# EAGLE board A20-OLINUXINO-MICRO_4GB_Rev_F1 (EAGLE 4.16), part 1 of 6
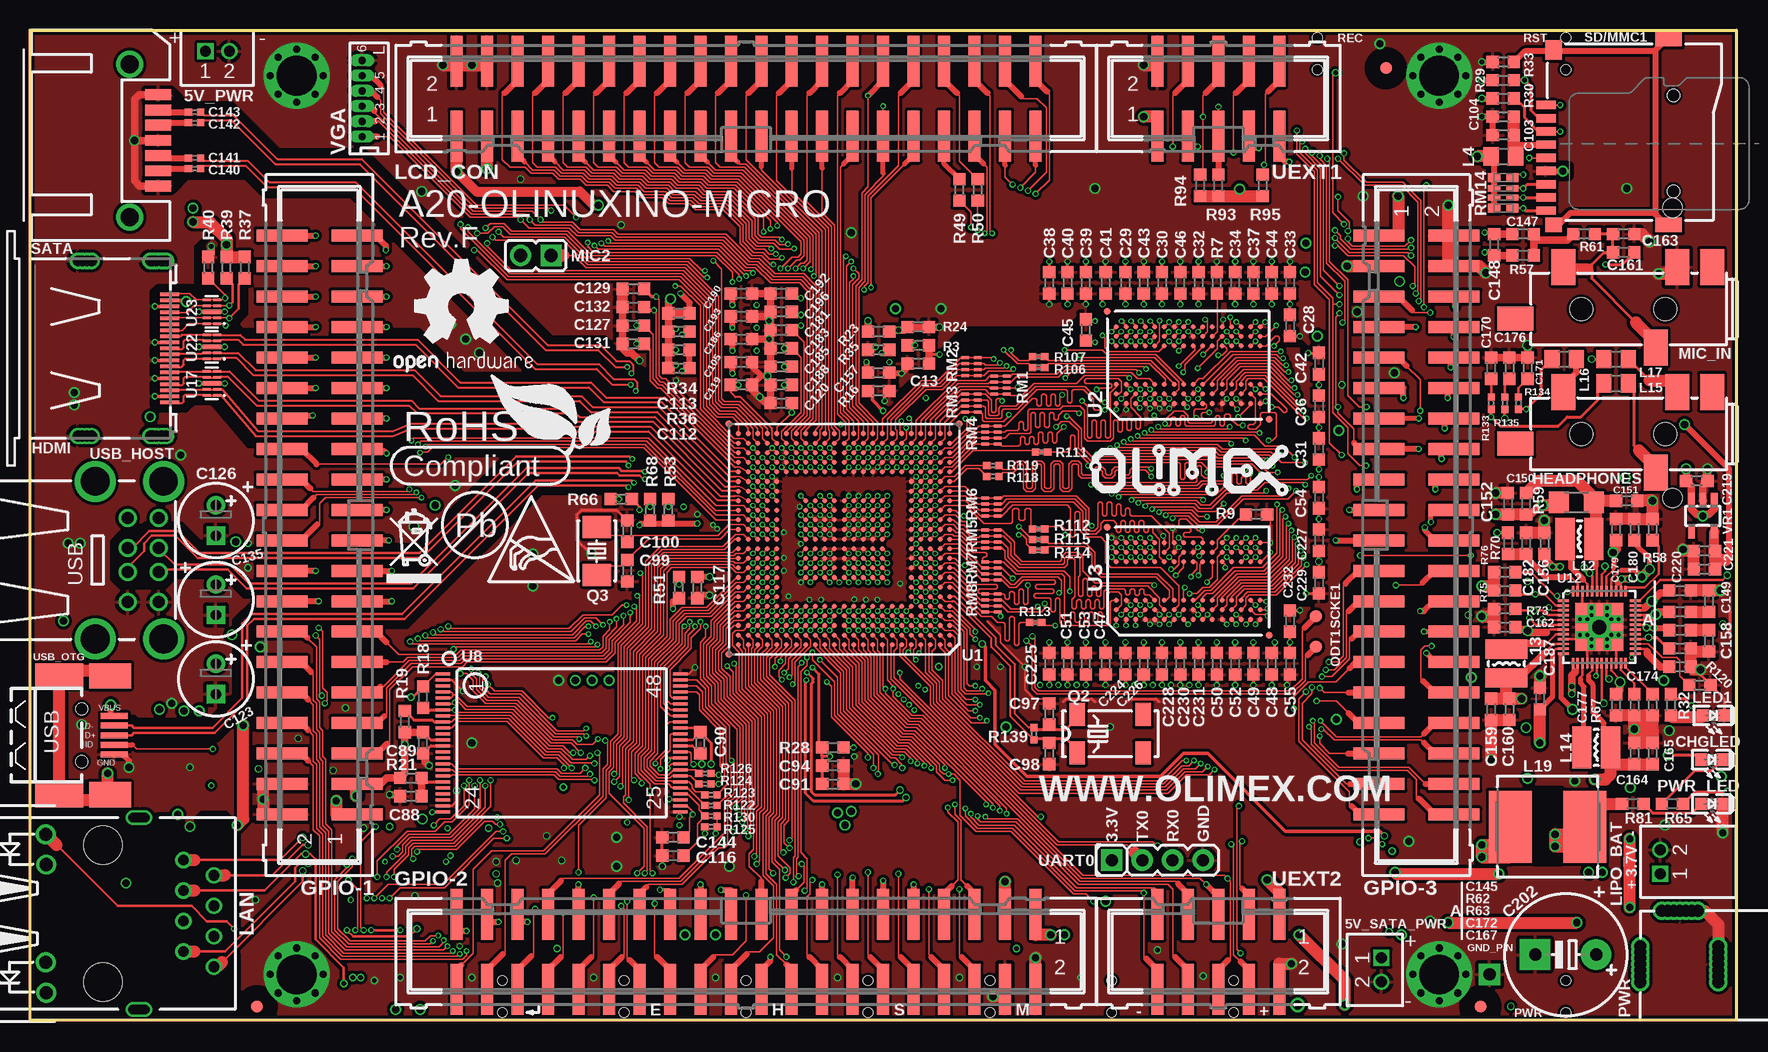
[diagram p5: board, top side]
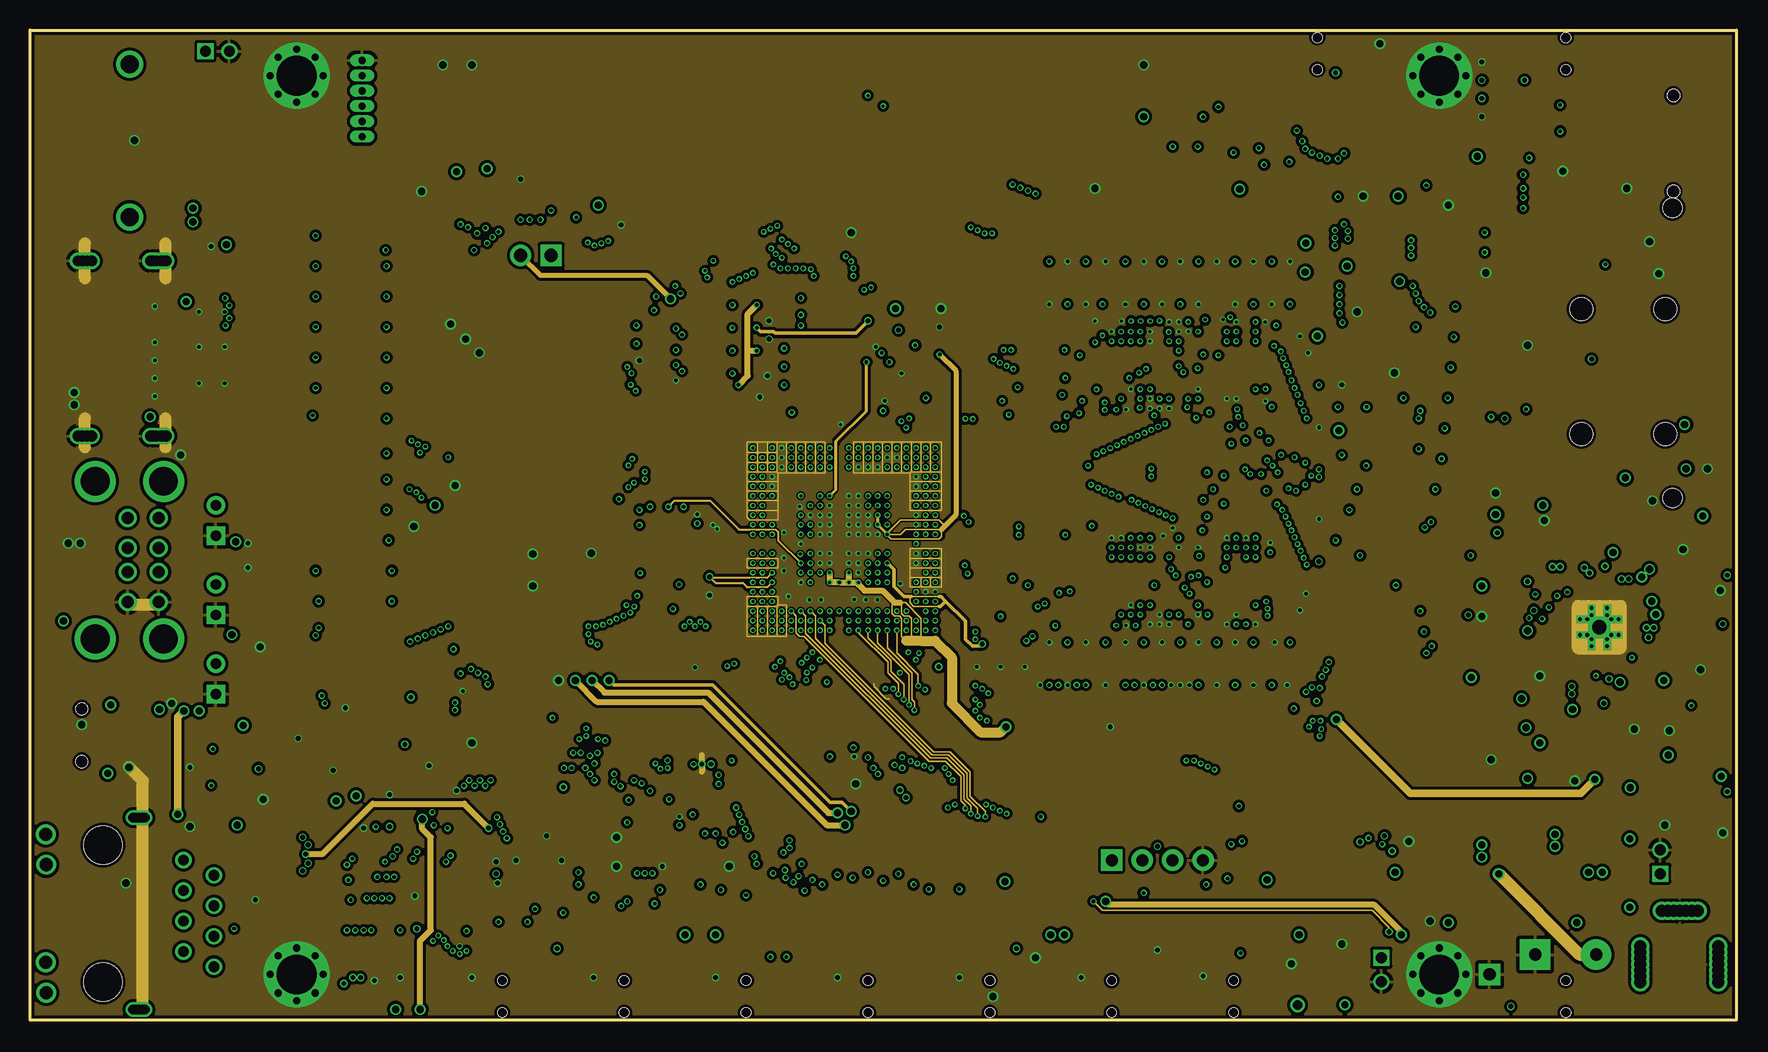
[diagram p6: board, inner layer Route2]
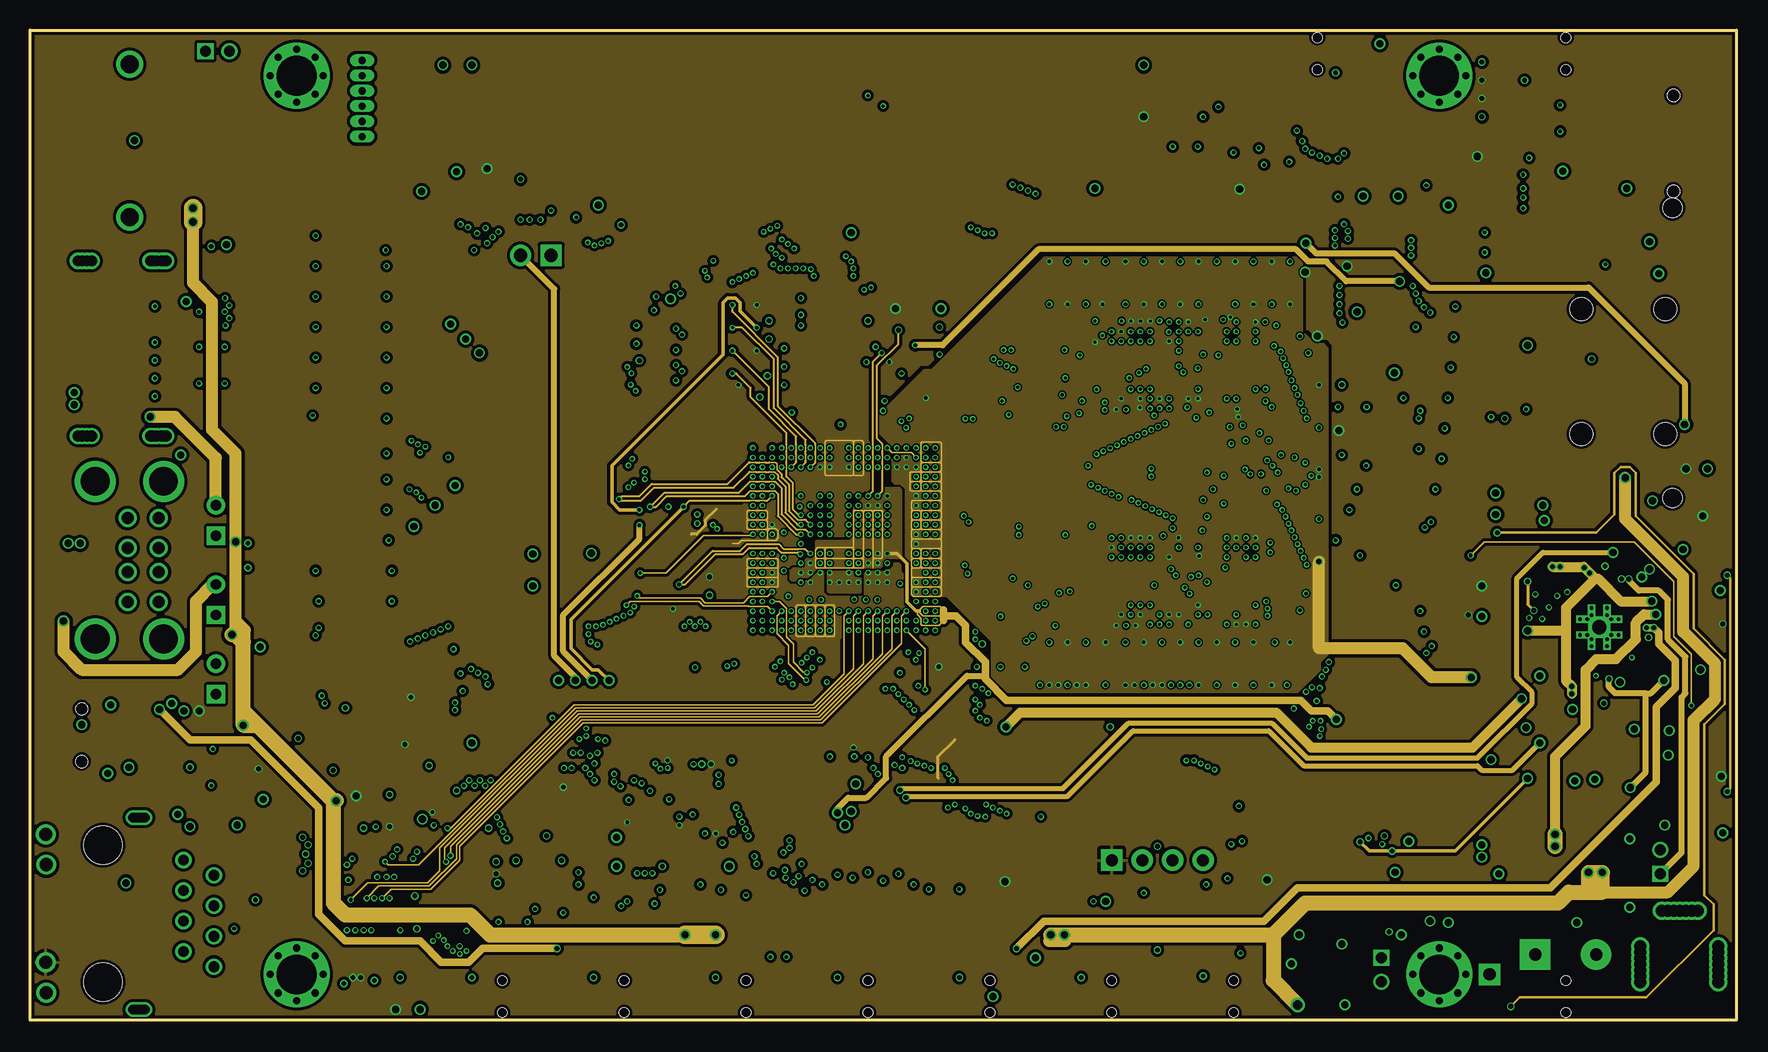
[diagram p7: board, inner layer Route15]
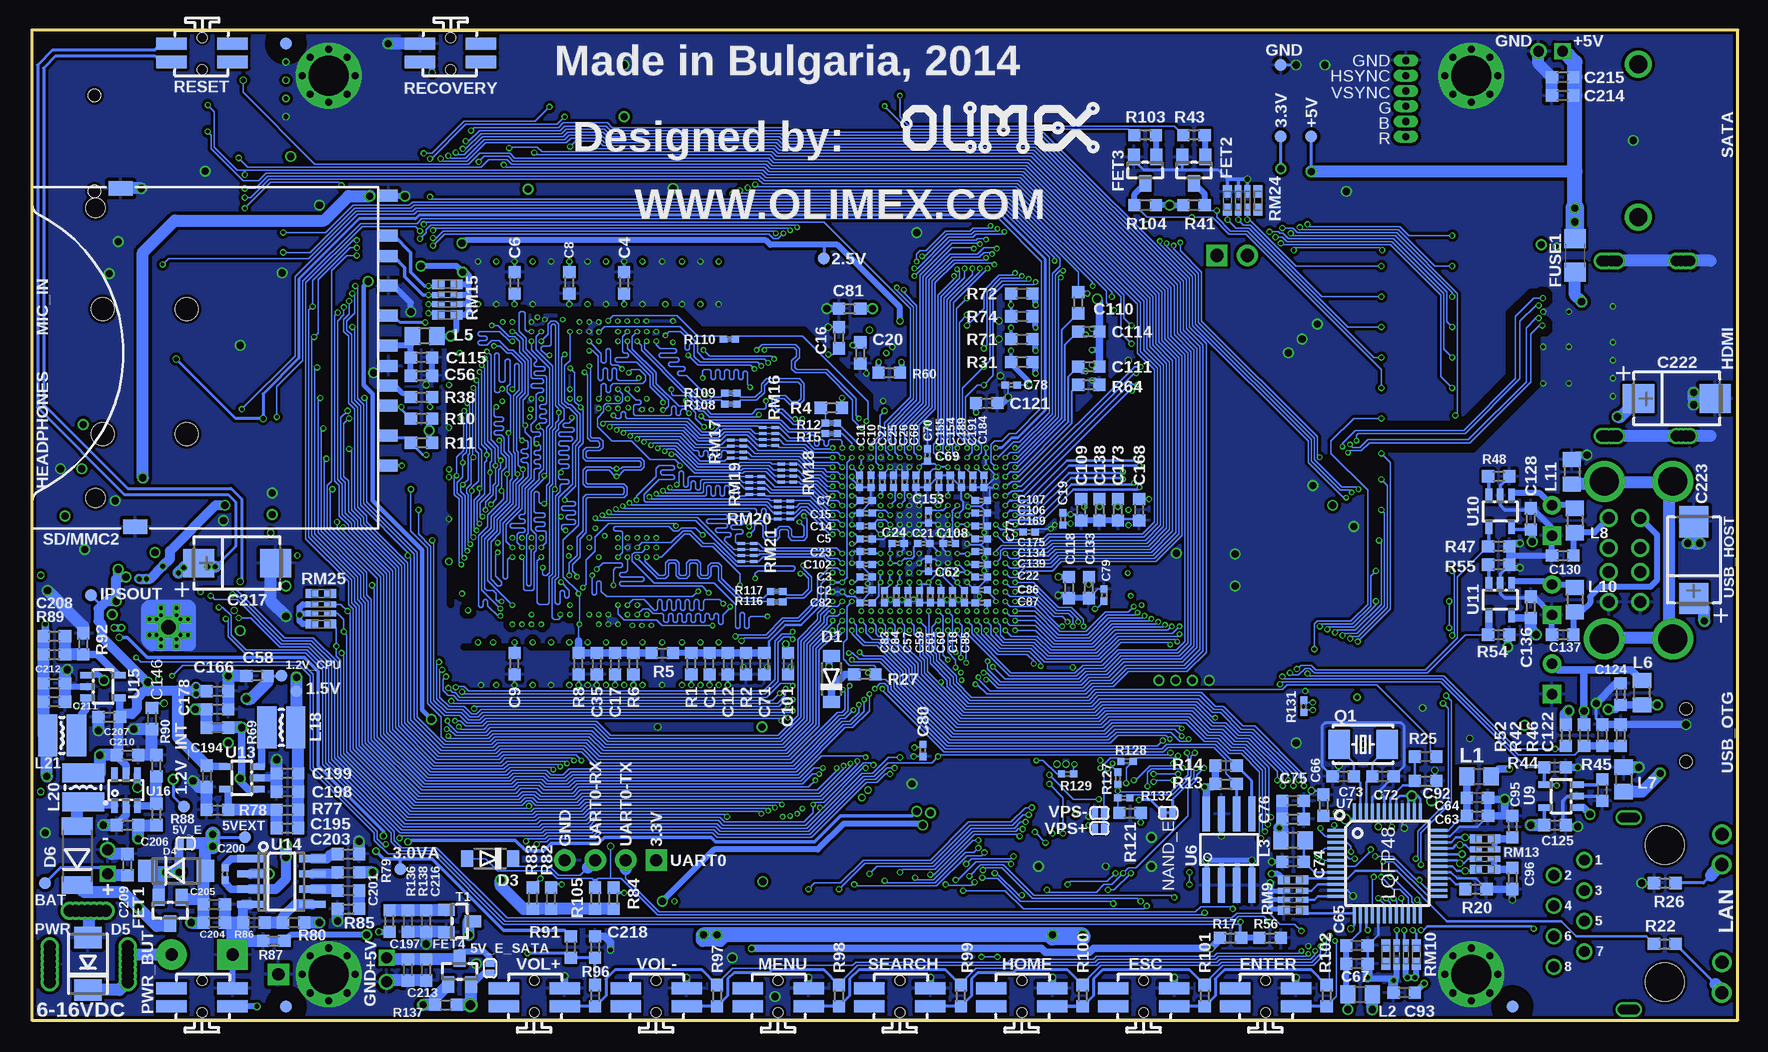
[diagram p8: board, bottom side, seen from below]

Size 142.24 x 82.55 mm. Coordinates in mm from the lower left corner, seen from the top.
Outline: 0,0 0,82.55 142.24,82.55 142.24,0 0,0
Copper layers (1*2*15*16): Top 0.018mm / dielectric 0.12mm / Route2 0.035mm / dielectric 1.2mm / Route15 0.035mm / dielectric 0.12mm / Bottom 0.018mm
Design rules "default": minimum track width 4.5mil, minimum drill 10mil, track to track 5mil, track to pad 5mil, pad to pad 5mil, via to via 5mil, smd to smd 1mil, copper to edge 10mil, drill to drill 8mil, minimum pad ring 6mil, minimum via ring 4mil, stop-mask expansion 4mil, vias tented up to drill 25mil, thermal gap 12mil
tRestrict: 315 lines
bRestrict: 272 lines

## Footprints (pad centres in the part's own frame; a part is rotated, then mirrored left to right if it is on the bottom)
TESTPAD_40-ROUND = smd 1.016 x 1.016: 1 0,0
SJ_1_SMALLER = smd 0.508 x 0.762: 1 -0.381,0; 2 0.381,0
DW02S = drill 0.9 square: 1 -1,0 | drill 0.9 round: 2 1,0
C0603_DWS = smd 1.016 x 1.016: 1 -0.889,0; 2 0.889,0
C0402_TI = smd 0.61 x 0.584: 1 -0.508,0; 2 0.508,0
E2,5-6,3 = drill 0.864 pad 1.524 round: + -1.27,0 | drill 0.864 pad 1.524 square: - 1.27,0
E5-10,5 = drill 1.016 pad 2.54 round: + -2.54,0 | drill 1.016 pad 2.54 square: - 2.54,0
CT7343 = smd 2.6 x 2.4: + 3.2,0; - -3.2,0
LED-0603 = smd 1.016 x 1.016: A 0.889,0; C -0.889,0
SOD-123 = smd 1 x 1.4: A 1.9,0; C -1.9,0
MLL-41 = smd 1.45 x 1.8: A 2.445,0; K -2.445,0
DO214AA = smd 1.778 x 2.286: A 2.177,0; C -2.177,0
MELF-MLL41 = smd 1.45 x 2.6: 1 -2.445,0; 2 2.445,0
SW_TAKT3X4 = smd 2.54 x 1.016: 1_1 -2.54,0.762; 1_2 2.54,0.762; 2_1 -2.54,-0.762; 2_2 2.54,-0.762 | hole 0.8: 0,-1.397; 0,1.27
SOT23 = smd 1.4 x 1: 1 1.1,-0.95; 2 1.1,0.95; 3 -1.1,0
1206 = smd 1.6 x 1.8: 1 -1.4,0; 2 1.4,0
TEST_PAD40/70/SQUARE = drill 1.016 pad 1.778 square: P$1 0,0
ML40-MALE(GBH-254-SMT-40) = smd 1 x 4.25: 1 -24.13,-3.125; 2 -24.13,3.125; 3 -21.59,-3.125; 4 -21.59,3.125; 5 -19.05,-3.125; 6 -19.05,3.125; 7 -16.51,-3.125; 8 -16.51,3.125; 9 -13.97,-3.125; 10 -13.97,3.125; 11 -11.43,-3.125; 12 -11.43,3.125; 13 -8.89,-3.125; 14 -8.89,3.125; 15 -6.35,-3.125; 16 -6.35,3.125; 17 -3.81,-3.125; 18 -3.81,3.125; 19 -1.27,-3.125; 20 -1.27,3.125; 21 1.27,-3.125; 22 1.27,3.125; 23 3.81,-3.125; 24 3.81,3.125; 25 6.35,-3.125; 26 6.35,3.125; 27 8.89,-3.125; 28 8.89,3.125; 29 11.43,-3.125; 30 11.43,3.125; 31 13.97,-3.125; 32 13.97,3.125; 33 16.51,-3.125; 34 16.51,3.125; 35 19.05,-3.125; 36 19.05,3.125; 37 21.59,-3.125; 38 21.59,3.125; 39 24.13,-3.125; 40 24.13,3.125
HDMI-SWM-19 = smd 0.28 x 1.6: 1 -4.5,-5.55; 2 -4,-5.55; 3 -3.5,-5.55; 4 -3,-5.55; 5 -2.5,-5.55; 6 -2,-5.55; 7 -1.5,-5.55; 8 -1,-5.55; 9 -0.5,-5.55; 10 0,-5.55; 11 0.5,-5.55; 12 1,-5.55; 13 1.5,-5.55; 14 2,-5.55; 15 2.5,-5.55; 16 3,-5.55; 17 3.5,-5.55; 18 4,-5.55; 19 4.5,-5.55 | drill 0.9 round: P$5 -7.3,-4.85; P$7 -7.3,1.35; P$9 7.3,1.35; P$11 7.3,-4.85; P$13 -7.3,-4.45; P$15 -7.3,1.75; P$18 7.3,1.75; P$20 7.3,-4.45; P$21 -7.3,-4.15; P$22 -7.3,-4.95; P$23 7.3,-4.95; P$24 7.3,-4.15; P$25 -7.3,-5.25; P$26 7.3,-5.25; P$27 7.3,0.95; P$28 -7.3,0.95; SH1 -7.3,-3.95; SH2 -7.3,2.1; SH3 7.3,2.1; SH4 7.3,-3.95
PJ-W47S-05D2-LF_5PIN_V2 = smd 2 x 3: 1 2.1,-0.5; 2 14.5,-0.5; 3 6.8,6.2; 5 5,-0.5 | smd 3 x 2: 4 18.5,3.8 | hole 1.9: 6,3; 13,3
L0805_5MIL_DWS = smd 1.27 x 1.524: 1 -1.016,0; 2 1.016,0
CD32 = smd 1.6 x 3.5: 1 -1.2,0; 2 1.2,0
8X8MM_3131 = smd 3.6 x 6: 1 -3.1,0; 2 3.1,0
RJLBC-060TC1_MILLING = drill 0.9 round: 1 -4.455,6.7; 2 -3.185,9.24; 3 -1.915,6.7; 4 -0.645,9.24; 5 0.625,6.7; 6 1.895,9.24; 7 3.165,6.7; 8 4.435,9.24 | drill 0.8 round: _1 -8,2.5; _2 -8,2.7; _3 -8,2.9; _4 -8,3.3; _5 -8,3.5; _6 8,3.5; _7 8,3.3; _8 8,2.9; _9 8,2.7; _10 8,2.5; GND1 -8,3.1; GND2 8,3.1 | drill 1.1 round: AG 4.07,-4.773; AY -6.61,-4.773; KG 6.61,-4.748; KY -4.07,-4.748 | hole 3.2: -5.715,0; 5.715,0
DW02R = drill 0.9 square: 1 -1,0 | drill 0.9 round: 2 1,0
JP1 = drill 1.1 pad 1.778 square: 1 0,-1.27 | drill 1.1 pad 1.778 round: 2 0,1.27
SJ_1_SMALLER_CLOSE_10MILS = smd 0.508 x 0.762: 1 -0.381,0; 2 0.381,0
PWR_JACK_UNI_MILLING = drill 1 round: + 0,4.75; +1 0,5.25; +2 0,5.75; +3 0,6.25; +4 0,4.25; +5 0,3.75; +6 0,3.25; - -6.5,4.75; -1 -6.5,5.25; -2 -6.5,5.75; -3 -6.5,4.25; -4 -6.5,3.75; -5 -6.5,6.25; -6 -6.5,3.25; -- -3.3,0.3; --1 -3.8,0.3; --2 -4.3,0.3; --3 -4.8,0.3; --4 -2.8,0.3; --5 -2.3,0.3; --6 -1.8,0.3
HCX-4S = smd 1.8 x 2.4: 1 -2,0; 2 2,0
MC-306 = smd 1.3 x 1.9: 1 -2.75,-1.6; 2 2.75,-1.6; 3 2.75,1.6; 4 -2.75,1.6
R0603_5MIL_DWS = smd 1.016 x 1.016: 1 -0.889,0; 2 0.889,0
R0402_TI_0R = smd 0.61 x 0.584: 1 -0.508,0; 2 0.508,0
0603_0R = smd 1.016 x 1.016: 1 -0.889,0; 2 0.889,0
R1206_5MIL_WS = smd 1.651 x 1.778: 1 -1.46,0; 2 1.46,0
R0402_TI = smd 0.61 x 0.584: 1 -0.508,0; 2 0.508,0
R_MATRIX_4_0402_25_625_0R = smd 0.25 x 0.625: 1.1 -0.75,-0.512; 1.2 -0.75,0.512; 2.1 -0.25,-0.512; 2.2 -0.25,0.512; 3.1 0.25,-0.512; 3.2 0.25,0.512; 4.1 0.75,-0.512; 4.2 0.75,0.512
R_MATRIX_4 = smd 0.762 x 1.016: 1.1 -1.27,-0.762; 1.2 -1.27,0.762; 4.1 1.27,-0.762; 4.2 1.27,0.762 | smd 0.508 x 1.016: 2.1 -0.381,-0.762; 2.2 -0.381,0.762; 3.1 0.381,-0.762; 3.2 0.381,0.762
SATA-PWA-07 = smd 0.9 x 2.2: 1 -4.25,-4.8; 2 -2.98,-4.8; 3 -1.71,-4.8; 4 -0.44,-4.8; 5 0.83,-4.8; 6 2.1,-4.8; 7 3.37,-4.8 | drill 1.5 round: P$8 -6.81,-2.44; P$9 5.93,-2.44
TFC-WPAPR-08 = smd 1.6 x 0.7: 1 -7.375,2.25; 2 -7.375,1.15; 3 -7.375,0.05; 4 -7.375,-1.05; 5 -7.375,-2.15; 6 -7.375,-3.25; 7 -7.375,-4.35; 8 -7.375,-5.45; 9 -7.375,-6.55 | smd 1.4 x 1.2: 10 -6.75,-7.75 | smd 1.4 x 1.6: 11 -6.75,6.85 | smd 2.2 x 1.2: 12 2.85,-7.75; 13 2.85,7.75 | hole 1: 3.25,-4.95; 3.25,3.05
SD_CARD = smd 1.5 x 1: 1 -15.3,6.48; 2 -15.3,3.98; 3 -15.3,0.68; 4 -15.3,-1.03; 5 -15.3,-3.53; 6 -15.3,-6.03; 7 -15.3,-8.46; 8 -15.3,-10.16; 9 -15.3,8.98; CD -15.3,2.33; WP -15.3,-13.51 | smd 2 x 1.2: SH1 7.05,-14.1; SH2 5.85,14.1 | hole 1.6: 9.15,-12.49; 9.15,11.7
TFBGA441 = smd 0.4 x 0.4: A1 -8.8,-8.8; A2 -8.8,-8; A3 -8.8,-7.2; A4 -8.8,-6.4; A5 -8.8,-5.6; A6 -8.8,-4.8; A7 -8.8,-4; A8 -8.8,-3.2; A9 -8.8,-2.4; A10 -8.8,-1.6; A11 -8.8,-0.8; A12 -8.8,0; A13 -8.8,0.8; A14 -8.8,1.6; A15 -8.8,2.4; A16 -8.8,3.2; A17 -8.8,4; A18 -8.8,4.8; A19 -8.8,5.6; A20 -8.8,6.4; A21 -8.8,7.2; A22 -8.8,8; A23 -8.8,8.8; AA1 7.2,-8.8; AA2 7.2,-8; AA3 7.2,-7.2; AA4 7.2,-6.4; AA5 7.2,-5.6; AA6 7.2,-4.8; AA7 7.2,-4; AA8 7.2,-3.2; AA9 7.2,-2.4; AA10 7.2,-1.6; AA11 7.2,-0.8; AA12 7.2,0; AA13 7.2,0.8; AA14 7.2,1.6; AA15 7.2,2.4; AA16 7.2,3.2; AA17 7.2,4; AA18 7.2,4.8; AA19 7.2,5.6; AA20 7.2,6.4; AA21 7.2,7.2; AA22 7.2,8; AA23 7.2,8.8; AB1 8,-8.8; AB2 8,-8; AB3 8,-7.2; AB4 8,-6.4; AB5 8,-5.6; AB6 8,-4.8; AB7 8,-4; AB8 8,-3.2; AB9 8,-2.4; AB10 8,-1.6; AB11 8,-0.8; AB12 8,0; AB13 8,0.8; AB14 8,1.6; AB15 8,2.4; AB16 8,3.2; AB17 8,4; AB18 8,4.8; AB19 8,5.6; AB20 8,6.4; AB21 8,7.2; AB22 8,8; AB23 8,8.8; AC1 8.8,-8.8; AC2 8.8,-8; AC3 8.8,-7.2; AC4 8.8,-6.4; AC5 8.8,-5.6; AC6 8.8,-4.8; AC7 8.8,-4; AC8 8.8,-3.2; AC9 8.8,-2.4; AC10 8.8,-1.6; AC11 8.8,-0.8; AC12 8.8,0; AC13 8.8,0.8; AC14 8.8,1.6; AC15 8.8,2.4; AC16 8.8,3.2; AC17 8.8,4; AC18 8.8,4.8; AC19 8.8,5.6; AC20 8.8,6.4; AC21 8.8,7.2; AC22 8.8,8; AC23 8.8,8.8; B1 -8,-8.8; B2 -8,-8; B3 -8,-7.2; B4 -8,-6.4; B5 -8,-5.6; B6 -8,-4.8; B7 -8,-4; B8 -8,-3.2; B9 -8,-2.4; B10 -8,-1.6; B11 -8,-0.8; B12 -8,0; B13 -8,0.8; B14 -8,1.6; B15 -8,2.4; B16 -8,3.2; B17 -8,4; B18 -8,4.8; B19 -8,5.6; B20 -8,6.4; B21 -8,7.2; B22 -8,8; B23 -8,8.8; C1 -7.2,-8.8; C2 -7.2,-8; C3 -7.2,-7.2; C4 -7.2,-6.4; C5 -7.2,-5.6; C6 -7.2,-4.8; C7 -7.2,-4; C8 -7.2,-3.2; C9 -7.2,-2.4; C10 -7.2,-1.6; C11 -7.2,-0.8; C12 -7.2,0; C13 -7.2,0.8; C14 -7.2,1.6; C15 -7.2,2.4; C16 -7.2,3.2; C17 -7.2,4; C18 -7.2,4.8; C19 -7.2,5.6; C20 -7.2,6.4; C21 -7.2,7.2; C22 -7.2,8; C23 -7.2,8.8; D1 -6.4,-8.8; D2 -6.4,-8; D3 -6.4,-7.2; D4 -6.4,-6.4; D5 -6.4,-5.6; D6 -6.4,-4.8; D7 -6.4,-4; D8 -6.4,-3.2; D9 -6.4,-2.4; D10 -6.4,-1.6; D11 -6.4,-0.8; D12 -6.4,0; D13 -6.4,0.8; D14 -6.4,1.6; D15 -6.4,2.4; D16 -6.4,3.2; D17 -6.4,4; D18 -6.4,4.8; D19 -6.4,5.6; D20 -6.4,6.4; D21 -6.4,7.2; D22 -6.4,8; D23 -6.4,8.8; E1 -5.6,-8.8; E2 -5.6,-8; E3 -5.6,-7.2; E4 -5.6,-6.4; E5 -5.6,-5.6; E6 -5.6,-4.8; E7 -5.6,-4; E8 -5.6,-3.2; E9 -5.6,-2.4; E10 -5.6,-1.6; E11 -5.6,-0.8; E12 -5.6,0; E13 -5.6,0.8; E14 -5.6,1.6; E15 -5.6,2.4; E16 -5.6,3.2; E17 -5.6,4; E18 -5.6,4.8; E19 -5.6,5.6; E20 -5.6,6.4; E21 -5.6,7.2; E22 -5.6,8; E23 -5.6,8.8; F1 -4.8,-8.8; F2 -4.8,-8; F3 -4.8,-7.2; F4 -4.8,-6.4; F5 -4.8,-5.6; F19 -4.8,5.6; F20 -4.8,6.4; F21 -4.8,7.2; F22 -4.8,8; F23 -4.8,8.8; G1 -4,-8.8; G2 -4,-8; G3 -4,-7.2; G4 -4,-6.4; G5 -4,-5.6; G19 -4,5.6; G20 -4,6.4; G21 -4,7.2; G22 -4,8; G23 -4,8.8; H1 -3.2,-8.8; H2 -3.2,-8; H3 -3.2,-7.2; H4 -3.2,-6.4; H5 -3.2,-5.6; H8 -3.2,-3.2; H9 -3.2,-2.4; H10 -3.2,-1.6; H11 -3.2,-0.8; H12 -3.2,0; H13 -3.2,0.8; H14 -3.2,1.6; H15 -3.2,2.4; H16 -3.2,3.2; H19 -3.2,5.6; H20 -3.2,6.4; H21 -3.2,7.2; H22 -3.2,8; H23 -3.2,8.8; J1 -2.4,-8.8; J2 -2.4,-8; J3 -2.4,-7.2; J4 -2.4,-6.4; J5 -2.4,-5.6; J8 -2.4,-3.2; J9 -2.4,-2.4; J10 -2.4,-1.6; J11 -2.4,-0.8; J12 -2.4,0; J13 -2.4,0.8; J14 -2.4,1.6; J15 -2.4,2.4; J16 -2.4,3.2; J19 -2.4,5.6; J20 -2.4,6.4; J21 -2.4,7.2; J22 -2.4,8; J23 -2.4,8.8; K1 -1.6,-8.8; K2 -1.6,-8; K3 -1.6,-7.2; K4 -1.6,-6.4; K5 -1.6,-5.6; K8 -1.6,-3.2; K9 -1.6,-2.4; K10 -1.6,-1.6; K11 -1.6,-0.8; K12 -1.6,0; K13 -1.6,0.8; K14 -1.6,1.6; K15 -1.6,2.4; K16 -1.6,3.2; K19 -1.6,5.6; K20 -1.6,6.4; K21 -1.6,7.2; K22 -1.6,8; K23 -1.6,8.8; L1 -0.8,-8.8; L2 -0.8,-8; L3 -0.8,-7.2; L4 -0.8,-6.4; L5 -0.8,-5.6; L8 -0.8,-3.2; L9 -0.8,-2.4; L10 -0.8,-1.6; L11 -0.8,-0.8; L12 -0.8,0; L13 -0.8,0.8; L14 -0.8,1.6; L15 -0.8,2.4; L16 -0.8,3.2; L19 -0.8,5.6; L20 -0.8,6.4; L21 -0.8,7.2; L22 -0.8,8; L23 -0.8,8.8; M1 0,-8.8; M2 0,-8; M3 0,-7.2; M4 0,-6.4; M5 0,-5.6; M8 0,-3.2; M9 0,-2.4; M10 0,-1.6; M11 0,-0.8; M12 0,0; M13 0,0.8; M14 0,1.6; M15 0,2.4; M16 0,3.2; M19 0,5.6; M20 0,6.4; M21 0,7.2; M22 0,8; M23 0,8.8; N1 0.8,-8.8; N2 0.8,-8; N3 0.8,-7.2; N4 0.8,-6.4; N5 0.8,-5.6; N8 0.8,-3.2; N9 0.8,-2.4; N10 0.8,-1.6; N11 0.8,-0.8; N12 0.8,0; N13 0.8,0.8; N14 0.8,1.6; N15 0.8,2.4; N16 0.8,3.2; N19 0.8,5.6; N20 0.8,6.4; N21 0.8,7.2; N22 0.8,8; N23 0.8,8.8; P1 1.6,-8.8; P2 1.6,-8; P3 1.6,-7.2; P4 1.6,-6.4; P5 1.6,-5.6; P8 1.6,-3.2; P9 1.6,-2.4; P10 1.6,-1.6; P11 1.6,-0.8; P12 1.6,0; P13 1.6,0.8; P14 1.6,1.6; P15 1.6,2.4; P16 1.6,3.2; P19 1.6,5.6; P20 1.6,6.4; P21 1.6,7.2; P22 1.6,8; P23 1.6,8.8; R1 2.4,-8.8; R2 2.4,-8; R3 2.4,-7.2; R4 2.4,-6.4; R5 2.4,-5.6; R8 2.4,-3.2; R9 2.4,-2.4; R10 2.4,-1.6; R11 2.4,-0.8; R12 2.4,0; R13 2.4,0.8; R14 2.4,1.6; R15 2.4,2.4; R16 2.4,3.2; R19 2.4,5.6; R20 2.4,6.4; R21 2.4,7.2; R22 2.4,8; R23 2.4,8.8; T1 3.2,-8.8; T2 3.2,-8; T3 3.2,-7.2; T4 3.2,-6.4; T5 3.2,-5.6; T8 3.2,-3.2; T9 3.2,-2.4; T10 3.2,-1.6; T11 3.2,-0.8; T12 3.2,0; T13 3.2,0.8; T14 3.2,1.6; T15 3.2,2.4; T16 3.2,3.2; T19 3.2,5.6; T20 3.2,6.4; T21 3.2,7.2; T22 3.2,8; T23 3.2,8.8; U1 4,-8.8; U2 4,-8; U3 4,-7.2; U4 4,-6.4; U5 4,-5.6; U19 4,5.6; U20 4,6.4; U21 4,7.2; U22 4,8; U23 4,8.8; V1 4.8,-8.8; V2 4.8,-8; V3 4.8,-7.2; V4 4.8,-6.4; V5 4.8,-5.6; V19 4.8,5.6; V20 4.8,6.4; V21 4.8,7.2; V22 4.8,8; V23 4.8,8.8; W1 5.6,-8.8; W2 5.6,-8; W3 5.6,-7.2; W4 5.6,-6.4; W5 5.6,-5.6; W6 5.6,-4.8; W7 5.6,-4; W8 5.6,-3.2; W9 5.6,-2.4; W10 5.6,-1.6; W11 5.6,-0.8; W12 5.6,0; W13 5.6,0.8; W14 5.6,1.6; W15 5.6,2.4; W16 5.6,3.2; W17 5.6,4; W18 5.6,4.8; W19 5.6,5.6; W20 5.6,6.4; W21 5.6,7.2; W22 5.6,8; W23 5.6,8.8; Y1 6.4,-8.8; Y2 6.4,-8; Y3 6.4,-7.2; Y4 6.4,-6.4; Y5 6.4,-5.6; Y6 6.4,-4.8; Y7 6.4,-4; Y8 6.4,-3.2; Y9 6.4,-2.4; Y10 6.4,-1.6; Y11 6.4,-0.8; Y12 6.4,0; Y13 6.4,0.8; Y14 6.4,1.6; Y15 6.4,2.4; Y16 6.4,3.2; Y17 6.4,4; Y18 6.4,4.8; Y19 6.4,5.6; Y20 6.4,6.4; Y21 6.4,7.2; Y22 6.4,8; Y23 6.4,8.8 | smd 0.6 x 0.6: FID1 -9.6,9.6; FID2 9.6,9.6; FID3 9.6,-9.6
FBGA96_MEM = smd 0.4 x 0.4: A1 -6,-3.2; A2 -6,-2.4; A3 -6,-1.6; A7 -6,1.6; A8 -6,2.4; A9 -6,3.2; B1 -5.2,-3.2; B2 -5.2,-2.4; B3 -5.2,-1.6; B7 -5.2,1.6; B8 -5.2,2.4; B9 -5.2,3.2; C1 -4.4,-3.2; C2 -4.4,-2.4; C3 -4.4,-1.6; C7 -4.4,1.6; C8 -4.4,2.4; C9 -4.4,3.2; D1 -3.6,-3.2; D2 -3.6,-2.4; D3 -3.6,-1.6; D7 -3.6,1.6; D8 -3.6,2.4; D9 -3.6,3.2; E1 -2.8,-3.2; E2 -2.8,-2.4; E3 -2.8,-1.6; E7 -2.8,1.6; E8 -2.8,2.4; E9 -2.8,3.2; F1 -2,-3.2; F2 -2,-2.4; F3 -2,-1.6; F7 -2,1.6; F8 -2,2.4; F9 -2,3.2; G1 -1.2,-3.2; G2 -1.2,-2.4; G3 -1.2,-1.6; G7 -1.2,1.6; G8 -1.2,2.4; G9 -1.2,3.2; H1 -0.4,-3.2; H2 -0.4,-2.4; H3 -0.4,-1.6; H7 -0.4,1.6; H8 -0.4,2.4; H9 -0.4,3.2; J1 0.4,-3.2; J2 0.4,-2.4; J3 0.4,-1.6; J7 0.4,1.6; J8 0.4,2.4; J9 0.4,3.2; K1 1.2,-3.2; K2 1.2,-2.4; K3 1.2,-1.6; K7 1.2,1.6; K8 1.2,2.4; K9 1.2,3.2; L1 2,-3.2; L2 2,-2.4; L3 2,-1.6; L7 2,1.6; L8 2,2.4; L9 2,3.2; M1 2.8,-3.2; M2 2.8,-2.4; M3 2.8,-1.6; M7 2.8,1.6; M8 2.8,2.4; M9 2.8,3.2; N1 3.6,-3.2; N2 3.6,-2.4; N3 3.6,-1.6; N7 3.6,1.6; N8 3.6,2.4; N9 3.6,3.2; P1 4.4,-3.2; P2 4.4,-2.4; P3 4.4,-1.6; P7 4.4,1.6; P8 4.4,2.4; P9 4.4,3.2; R1 5.2,-3.2; R2 5.2,-2.4; R3 5.2,-1.6; R7 5.2,1.6; R8 5.2,2.4; R9 5.2,3.2; T1 6,-3.2; T2 6,-2.4; T3 6,-1.6; T7 6,1.6; T8 6,2.4; T9 6,3.2 | smd 0.6 x 0.6: FID1 6.75,-4.5; FID2 -6.75,4.5
FIDUCIAL-1X3 = smd 1 x 1: 1 0,0
SO-08MN = smd 0.61 x 2.921: 1 -1.905,-2.981; 2 -0.635,-2.981; 3 0.635,-2.981; 4 1.905,-2.981; 5 1.905,2.981; 6 0.635,2.981; 7 -0.635,2.981; 8 -1.905,2.981
LQFP48 = smd 0.254 x 1.4: 1 -2.75,-4.3; 2 -2.25,-4.3; 3 -1.75,-4.3; 4 -1.25,-4.3; 5 -0.75,-4.3; 6 -0.25,-4.3; 7 0.25,-4.3; 8 0.75,-4.3; 9 1.25,-4.3; 10 1.75,-4.3; 11 2.25,-4.3; 12 2.75,-4.3; 25 2.75,4.3; 26 2.25,4.3; 27 1.75,4.3; 28 1.25,4.3; 29 0.75,4.3; 30 0.25,4.3; 31 -0.25,4.3; 32 -0.75,4.3; 33 -1.25,4.3; 34 -1.75,4.3; 35 -2.25,4.3; 36 -2.75,4.3 | smd 1.4 x 0.254: 13 4.3,-2.75; 14 4.3,-2.25; 15 4.3,-1.75; 16 4.3,-1.25; 17 4.3,-0.75; 18 4.3,-0.25; 19 4.3,0.25; 20 4.3,0.75; 21 4.3,1.25; 22 4.3,1.75; 23 4.3,2.25; 24 4.3,2.75; 37 -4.3,2.75; 38 -4.3,2.25; 39 -4.3,1.75; 40 -4.3,1.25; 41 -4.3,0.75; 42 -4.3,0.25; 43 -4.3,-0.25; 44 -4.3,-0.75; 45 -4.3,-1.25; 46 -4.3,-1.75; 47 -4.3,-2.25; 48 -4.3,-2.75
TSOP48 = smd 1.2 x 0.25: 1 -9.9,5.75; 2 -9.9,5.25; 3 -9.9,4.75; 4 -9.9,4.25; 5 -9.9,3.75; 6 -9.9,3.25; 7 -9.9,2.75; 8 -9.9,2.25; 9 -9.9,1.75; 10 -9.9,1.25; 11 -9.9,0.75; 12 -9.9,0.25; 13 -9.9,-0.25; 14 -9.9,-0.75; 15 -9.9,-1.25; 16 -9.9,-1.75; 17 -9.9,-2.25; 18 -9.9,-2.75; 19 -9.9,-3.25; 20 -9.9,-3.75; 21 -9.9,-4.25; 22 -9.9,-4.75; 23 -9.9,-5.25; 24 -9.9,-5.75; 25 9.9,-5.75; 26 9.9,-5.25; 27 9.9,-4.75; 28 9.9,-4.25; 29 9.9,-3.75; 30 9.9,-3.25; 31 9.9,-2.75; 32 9.9,-2.25; 33 9.9,-1.75; 34 9.9,-1.25; 35 9.9,-0.75; 36 9.9,-0.25; 37 9.9,0.25; 38 9.9,0.75; 39 9.9,1.25; 40 9.9,1.75; 41 9.9,2.25; 42 9.9,2.75; 43 9.9,3.25; 44 9.9,3.75; 45 9.9,4.25; 46 9.9,4.75; 47 9.9,5.25; 48 9.9,5.75
SOT23-5 = smd 1.2 x 0.55: 1 1.3,-0.95; 2 1.3,0; 3 1.3,0.95; 4 -1.3,0.95; 5 -1.3,-0.95
QFN48 = smd 0.2 x 0.9: 1 -2.2,-3; 2 -1.8,-3; 3 -1.4,-3; 4 -1,-3; 5 -0.6,-3; 6 -0.2,-3; 7 0.2,-3; 8 0.6,-3; 9 1,-3; 10 1.4,-3; 11 1.8,-3; 12 2.2,-3; 25 2.2,3; 26 1.8,3; 27 1.4,3; 28 1,3; 29 0.6,3; 30 0.2,3; 31 -0.2,3; 32 -0.6,3; 33 -1,3; 34 -1.4,3; 35 -1.8,3; 36 -2.2,3 | smd 0.9 x 0.2: 13 3,-2.2; 14 3,-1.8; 15 3,-1.4; 16 3,-1; 17 3,-0.6; 18 3,-0.2; 19 3,0.2; 20 3,0.6; 21 3,1; 22 3,1.4; 23 3,1.8; 24 3,2.2; 37 -3,2.2; 38 -3,1.8; 39 -3,1.4; 40 -3,1; 41 -3,0.6; 42 -3,0.2; 43 -3,-0.2; 44 -3,-0.6; 45 -3,-1; 46 -3,-1.4; 47 -3,-1.8; 48 -3,-2.2 | drill 1.2 pad 1.422 square: N1 0,0 | drill 0.3 pad 0.4 square: N2 -1.6,0.65; N3 -1,0.65; N4 -1.6,-0.65; N5 -1,-0.65; N6 -0.65,-1.6; N7 -0.65,-1; N8 0.65,-1.6; N9 0.65,-1; N10 1.6,-0.65; N11 1,-0.65; N12 1.6,0.65; N13 1,0.65; N14 0.65,1.6; N15 0.65,1; N16 -0.65,1.6; N17 -0.65,1 | smd 4 x 4: VSS 0,0
SOIC8 = smd 0.6 x 2.2: 1 -1.905,-2.6; 2 -0.635,-2.6; 3 0.635,-2.6; 4 1.905,-2.6; 5 1.905,2.6; 6 0.635,2.6; 7 -0.635,2.6; 8 -1.905,2.6
SOT23-6 = smd 0.55 x 1.2: 1 -0.95,-1.3; 2 0,-1.3; 3 0.95,-1.3; 4 0.95,1.3; 5 0,1.3; 6 -0.95,1.3
SLP2510P8 = smd 0.2 x 0.675: 1 -1,-0.438; 2 -0.5,-0.438; 4 0.5,-0.438; 5 1,-0.438; 6 1,0.438; 7 0.5,0.438; 9 -0.5,0.438; 10 -1,0.438 | smd 0.4 x 0.775: 3 0,-0.388; 8 0,0.388
HN1X4 = drill 1 pad 1.778 square: 1 -3.81,0 | drill 1 pad 1.778 round: 2 -1.27,0; 3 1.27,0; 4 3.81,0
ML10_S = smd 1 x 4.25: 1 -5.08,-3.125; 2 -5.08,3.125; 3 -2.54,-3.125; 4 -2.54,3.125; 5 0,-3.125; 6 0,3.125; 7 2.54,-3.125; 8 2.54,3.125; 9 5.08,-3.125; 10 5.08,3.125
USB_TWO_LEVEL = drill 1 round: 1.1 -3.5,2.62; 1.2 -1,2.62; 1.3 1,2.62; 1.4 3.5,2.62; 2.1 -3.5,0; 2.2 -1,0; 2.3 1,0; 2.4 3.5,0 | drill 2.4 round: GND1 -6.57,-2.7; GND2 6.57,-2.7; GND3 6.57,3; GND4 -6.57,3
USB_MINI_9PIN = smd 2.25 x 0.5: D+ 2.706,0; D- 2.706,0.8; GND 2.706,-1.6; ID 2.706,-0.8; VBUS 2.706,1.6 | smd 4 x 2.1: GND1 -1.9,4.95; GND3 -1.9,-4.95 | smd 3.5 x 2.1: GND2 2.35,4.95; GND4 2.35,-4.95 | hole 1: 0,2.2; 0,-2.2
CON1.27MM-6-SMALL_ICSP = drill 0.6 pad 1.016 long: 1 -3.175,0; 2 -1.905,0; 3 -0.635,0; 4 0.635,0; 5 1.905,0; 6 3.175,0
SOT-23-5 = smd 0.55 x 1.2: 1 -0.95,-1.3; 2 0,-1.3; 3 0.95,-1.3; 4 0.95,1.3; 5 -0.95,1.3

## Placement (x,y rotation side)
1.2V_CPU  TESTPADTESTPAD_40-ROUND  [TESTPAD_40-ROUND]  121.41,28.7 0 bottom
1.2V_INT  TESTPADTESTPAD_40-ROUND  [TESTPAD_40-ROUND]  129.54,17.78 0 bottom
1.5V  TESTPADTESTPAD_40-ROUND  [TESTPAD_40-ROUND]  120.14,27.43 0 bottom
2.5V  TESTPADTESTPAD_40-ROUND  [TESTPAD_40-ROUND]  76.2,63.5 0 bottom
3.0VA  TESTPADTESTPAD_40-ROUND  [TESTPAD_40-ROUND]  111.51,12.57 0 bottom
3.3V  TESTPADTESTPAD_40-ROUND  [TESTPAD_40-ROUND]  38.1,73.66 0 bottom
5V_E  Open  [SJ_1_SMALLER]  129.41,14.73 180 bottom
5V_E_SATA  [SJ_1_SMALLER]  104.01,4.32 90 bottom
5V_PWR  NA(DW02S)  [DW02S]  15.62,80.77 0 top
5V_SATA_PWR  DW02S  [DW02S]  112.65,4.19 270 top
5VEXT  TESTPADTESTPAD_40-ROUND  [TESTPAD_40-ROUND]  124.46,15.24 0 bottom
+5V  TESTPADTESTPAD_40-ROUND  [TESTPAD_40-ROUND]  35.56,73.66 0 bottom
BAT  TESTPADTESTPAD_40-ROUND  [TESTPAD_40-ROUND]  141.1,11.43 0 bottom
C1  220nF  [C0603_DWS]  85.72,29.72 90 bottom
C2  220nF  [C0402_TI]  72.67,35.86 180 bottom
C3  220nF  [C0402_TI]  72.67,36.93 180 bottom
C4  220nF  [C0603_DWS]  92.84,61.47 270 bottom
C5  220nF  [C0402_TI]  72.67,40.13 180 bottom
C6  220nF  [C0603_DWS]  101.98,61.47 270 bottom
C7  220nF  [C0402_TI]  72.67,43.33 180 bottom
C8  220nF  [C0603_DWS]  97.41,61.47 90 bottom
C9  220nF  [C0603_DWS]  101.98,29.72 90 bottom
C10  220nF  [C0402_TI]  72.26,44.91 90 bottom
C11  220nF  [C0402_TI]  73.2,44.91 90 bottom
C12  220nF  [C0603_DWS]  84.2,29.72 90 bottom
C13  22uF/6.3V  [C0603_DWS]  74.04,54.74 0 top
C14  220nF  [C0402_TI]  72.67,41.2 0 bottom
C15  220nF  [C0402_TI]  72.67,42.27 0 bottom
C16  220nF  [C0603_DWS]  74.93,56.9 270 bottom
C17  220nF  [C0603_DWS]  93.6,29.72 90 bottom
C18  220nF  [C0402_TI]  65.46,35.31 90 bottom
C19  220nF  [C0402_TI]  56.26,41.78 270 bottom
C20  220nF  [C0603_DWS]  73.15,55.63 90 bottom
C21  220nF  [C0402_TI]  67.87,39.75 180 bottom
C22  220nF  [C0402_TI]  63.07,36.93 180 bottom
C23  220nF  [C0402_TI]  72.67,39.07 0 bottom
C24  220nF  [C0402_TI]  70,39.75 180 bottom
C25  220nF  [C0402_TI]  70.38,44.91 270 bottom
C26  220nF  [C0402_TI]  69.44,44.91 270 bottom
C27  220nF  [C0402_TI]  71.32,44.91 270 bottom
C28  220nF  [C0603_DWS]  105.03,57.91 90 top
C29  220nF  [C0603_DWS]  91.31,61.47 90 top
C30  220nF  [C0603_DWS]  94.36,61.47 90 top
C31  220nF  [C0603_DWS]  107.44,47.62 270 top
C32  220nF  [C0603_DWS]  97.41,61.47 90 top
C33  220nF  [C0603_DWS]  105.03,61.47 270 top
C34  220nF  [C0603_DWS]  100.46,61.47 90 top
C35  220nF  [C0603_DWS]  95.12,29.72 90 bottom
C36  220nF  [C0603_DWS]  107.44,51.18 90 top
C37  220nF  [C0603_DWS]  101.98,61.47 270 top
C38  220nF  [C0603_DWS]  84.96,61.47 90 top
C39  220nF  [C0603_DWS]  88.01,61.47 90 top
C40  220nF  [C0603_DWS]  86.49,61.47 270 top
C41  220nF  [C0603_DWS]  89.66,61.47 270 top
C42  220nF  [C0603_DWS]  107.44,54.74 270 top
C43  220nF  [C0603_DWS]  92.84,61.47 270 top
C44  220nF  [C0603_DWS]  103.5,61.47 90 top
C45  220nF  [C0603_DWS]  88.01,57.53 270 top
C46  220nF  [C0603_DWS]  95.88,61.47 270 top
C47  220nF  [C0603_DWS]  89.66,29.72 90 top
C48  220nF  [C0603_DWS]  103.5,29.72 270 top
C49  220nF  [C0603_DWS]  101.98,29.72 90 top
C50  220nF  [C0603_DWS]  98.93,29.72 90 top
C51  220nF  [C0603_DWS]  86.49,29.72 90 top
C52  220nF  [C0603_DWS]  100.46,29.72 270 top
C53  220nF  [C0603_DWS]  88.01,29.72 270 top
C54  220nF  [C0603_DWS]  107.44,43.56 90 top
C55  220nF  [C0603_DWS]  105.03,29.72 90 top
C56  22uF/6.3V  [C0603_DWS]  109.73,53.72 180 bottom
C57  220nF  [C0402_TI]  69.19,35.31 90 bottom
C58  220nF  [C0603_DWS]  123.44,28.7 0 bottom
C59  220nF  [C0402_TI]  68.22,35.31 90 bottom
C60  220nF  [C0402_TI]  66.42,35.31 90 bottom
C61  220nF  [C0402_TI]  67.32,35.31 90 bottom
C62  220nF  [C0402_TI]  67.49,37.92 270 bottom
C63  100nF  [C0603_DWS]  21.72,17.02 180 bottom
C64  22uF/6.3V  [C0603_DWS]  21.72,18.54 180 bottom
C65  100nF  [C0603_DWS]  31.75,6.22 180 bottom
C66  100nF  [C0603_DWS]  34.54,17.91 270 bottom
C67  22uF/6.3V  [C0603_DWS]  31.75,4.7 180 bottom
C68  220nF  [C0402_TI]  68.5,44.91 90 bottom
C69  220nF  [C0402_TI]  67.56,47.12 270 bottom
C70  220nF  [C0402_TI]  67.56,44.91 90 bottom
C71  NA  [C0603_DWS]  81.15,29.72 90 bottom
C72  33pF  [C0603_DWS]  29.59,20.32 180 bottom
C73  33pF  [C0603_DWS]  32.89,20.32 0 bottom
C74  100nF  [C0603_DWS]  37.08,13.21 180 bottom
C75  100nF  [C0603_DWS]  37.08,18.29 0 bottom
C76  22uF/6.3V  [C0603_DWS]  37.08,16.76 0 bottom
C77  220nF  [C0402_TI]  59.08,40.69 180 bottom
C78  220nF  [C0402_TI]  60.58,52.96 0 bottom
C79  220nF  [C0402_TI]  52.83,35.43 270 bottom
C80  220nF  [C0402_TI]  67.94,22.48 90 bottom
C81  220nF  [C0603_DWS]  74.04,59.31 0 bottom
C82  220nF  [C0402_TI]  72.67,34.8 0 bottom
C83  220nF  [C0402_TI]  71.12,35.31 90 bottom
C84  220nF  [C0402_TI]  70.15,35.31 90 bottom
C85  220nF  [C0402_TI]  64.49,35.31 90 bottom
C86  220nF  [C0402_TI]  63.07,35.86 0 bottom
C87  220nF  [C0402_TI]  63.07,34.8 0 bottom
C88  100nF  [C0603_DWS]  31.75,18.67 0 top
C89  100nF  [C0603_DWS]  32.77,23.11 90 top
C90  100nF  [C0603_DWS]  55.88,23.11 90 top
C91  1uF  [C0603_DWS]  66.93,19.68 180 top
C92  100nF  [C0603_DWS]  26.04,19.94 180 bottom
C93  100nF  [C0603_DWS]  27.81,2.29 0 bottom
C94  100nF  [C0603_DWS]  66.93,21.21 180 top
C95  100nF  [C0603_DWS]  18.8,16.13 270 bottom
C96  100nF  [C0603_DWS]  18.8,11.81 90 bottom
C97  10pF  [C0603_DWS]  84.96,25.53 270 top
C98  10pF  [C0603_DWS]  84.96,22.22 90 top
C99  33pF  [C0603_DWS]  49.78,37.47 90 top
C100  33pF  [C0603_DWS]  49.78,40.77 270 top
C101  22uF/6.3V  [C0603_DWS]  79.18,29.72 90 bottom
C102  100nF  [C0402_TI]  72.67,38 0 bottom
C103  22uF/6.3V  [C0603_DWS]  122.81,73.79 0 top
C104  22uF/6.3V  [C0603_DWS]  122.81,75.31 0 top
C105  22uF/6.3V  [C0603_DWS]  59.31,54.86 180 top
C106  220nF  [C0402_TI]  63.07,42.27 180 bottom
C107  NC  [C0402_TI]  63.07,43.33 180 bottom
C108  NC  [C0402_TI]  65.74,39.75 0 bottom
C109  22uF/6.3V  [C0603_DWS]  54.74,42.55 90 bottom
C110  1uF  [C0603_DWS]  54.99,59.82 270 bottom
C111  220nF  [C0603_DWS]  54.1,54.48 180 bottom
C112  10uF/6.3V  [C0603_DWS]  54.1,54.36 0 top
C113  10uF/6.3V  [C0603_DWS]  54.1,57.4 0 top
C114  220nF  [C0603_DWS]  54.1,57.4 180 bottom
C115  22uF/6.3V  [C0603_DWS]  109.73,55.25 180 bottom
C116  NA(2.2uF)  [C0603_DWS]  53.59,13.72 180 top
C117  220nF  [C0603_DWS]  55.63,36.07 90 top
C118  220nF  [C0603_DWS]  55.75,36.07 90 bottom
C119  220nF  [C0603_DWS]  59.31,52.96 180 top
C120  220nF  [C0603_DWS]  62.61,51.44 0 top
C121  10uF/6.3V  [C0603_DWS]  62.61,51.44 180 bottom
C122  100nF  [C0603_DWS]  9.78,23.75 90 bottom
C123  100uF/16V/LOWESR/105C/6.3x11mm_RM2.5  [E2,5-6,3]  15.49,28.45 270 top
C124  100nF  [C0603_DWS]  9.78,27.18 90 bottom
C125  100nF  [C0603_DWS]  15.24,16.26 0 bottom
C126  100uF/16V/LOWESR/105C/6.3x11mm_RM2.5  [E2,5-6,3]  15.49,41.66 270 top
C127  1nF  [C0603_DWS]  50.29,57.91 0 top
C128  10uF/6.3V  [C0603_DWS]  17.27,41.78 90 bottom
C129  1nF  [C0603_DWS]  50.29,60.96 0 top
C130  100nF  [C0603_DWS]  14.61,38.73 180 bottom
C131  1nF  [C0603_DWS]  50.29,56.39 0 top
C132  1nF  [C0603_DWS]  50.29,59.44 0 top
C133  22uF/6.3V  [C0603_DWS]  54.1,36.07 90 bottom
C134  220nF  [C0402_TI]  63.07,39.07 180 bottom
C135  100uF/16V/LOWESR/105C/6.3x11mm_RM2.5  [E2,5-6,3]  15.49,35.05 270 top
C136  10uF/6.3V  [C0603_DWS]  17.27,34.42 90 bottom
C137  100nF  [C0603_DWS]  14.61,32.13 180 bottom
C138  22uF/6.3V  [C0603_DWS]  53.21,42.55 90 bottom
C139  220nF  [C0402_TI]  63.07,38 180 bottom
C140  10nF  [C0402_TI]  13.72,70.99 180 top
C141  10nF  [C0402_TI]  13.72,71.88 180 top
C142  10nF  [C0402_TI]  13.72,74.8 180 top
C143  10nF  [C0402_TI]  13.72,75.69 180 top
C144  NA(2.2uF)  [C0603_DWS]  53.59,15.24 180 top
C145  10uF/6.3V  [C0603_DWS]  137.54,35.81 180 top
C146  1uF  [C0603_DWS]  132.21,25.15 90 bottom
C147  10uF/6.3V  [C0603_DWS]  124.46,65.53 0 top
C148  10uF/6.3V  [C0603_DWS]  122.05,64.64 270 top
C149  10uF/6.3V  [C0603_DWS]  139.95,34.93 270 top
C150  1uF  [C0603_DWS]  124.71,43.05 270 top
C151  10uF/6.3V  [C0603_DWS]  133.1,43.31 0 top
C152  10uF/6.3V  [C0603_DWS]  123.19,43.05 90 top
C153  NA  [C0402_TI]  67.49,41.96 270 bottom
C154  NA  [C0402_TI]  65.66,44.91 90 bottom
C155  220nF  [C0402_TI]  66.6,44.91 90 bottom
C156  10uF/6.3V  [C0603_DWS]  126.24,39.75 90 top
C157  22uF/6.3V  [C0603_DWS]  70.74,53.98 180 top
C158  10uF/6.3V  [C0603_DWS]  139.95,31.62 90 top
C159  10uF/6.3V  [C0603_DWS]  121.79,25.91 270 top
C160  1nF  [C0603_DWS]  123.32,25.91 270 top
C161  100nF  [C0603_DWS]  132.84,64.01 0 top
C162  10uF/6.3V  [C0603_DWS]  122.94,32.77 180 top
C163  3.3nF  [C0603_DWS]  132.84,65.53 180 top
C164  10uF/6.3V  [C0603_DWS]  133.73,22.22 90 top
C165  1nF  [C0603_DWS]  135.25,22.22 90 top
C166  10uF/6.3V  [C0603_DWS]  126.75,27.43 0 bottom
C167  1uF  [C0603_DWS]  137.54,29.46 180 top
C168  22uF/6.3V  [C0603_DWS]  49.91,42.55 90 bottom
C169  220nF  [C0402_TI]  63.07,41.2 180 bottom
C170  100nF  [C0603_DWS]  121.79,54.36 270 top
C171  100nF  [C0603_DWS]  124.84,54.36 270 top
C172  10uF/6.3V  [C0603_DWS]  137.54,30.99 0 top
C173  22uF/6.3V  [C0603_DWS]  51.69,42.55 90 bottom
C174  1uF  [C0603_DWS]  135.25,26.29 90 top
C175  220nF  [C0402_TI]  63.07,40.13 180 bottom
C176  100nF  [C0603_DWS]  123.32,54.36 270 top
C177  10uF/6.3V  [C0603_DWS]  132.21,26.29 90 top
C178  10uF/6.3V  [C0603_DWS]  126.75,25.91 0 bottom
C179  10uF/6.3V  [C0603_DWS]  132.21,40.89 90 top
C180  10uF/6.3V  [C0603_DWS]  133.73,40.89 90 top
C181  NA  [C0603_DWS]  62.61,57.53 0 top
C182  1nF  [C0603_DWS]  124.71,39.75 270 top
C183  NA  [C0603_DWS]  62.61,56.01 0 top
C184  220nF  [C0402_TI]  62.84,44.91 270 bottom
C185  NA  [C0603_DWS]  62.61,54.48 0 top
C186  22uF/6.3V  [C0603_DWS]  59.31,56.77 180 top
C187  10uF/6.3V  [C0603_DWS]  125.86,26.8 90 top
C188  NA  [C0603_DWS]  62.61,52.96 0 top
C189  220nF  [C0402_TI]  64.72,44.91 270 bottom
C190  22uF/6.3V  [C0603_DWS]  59.31,60.58 180 top
C191  220nF  [C0402_TI]  63.78,44.91 270 bottom
C192  470nF  [C0603_DWS]  62.61,60.58 0 top
C193  22uF/6.3V  [C0603_DWS]  59.31,58.67 180 top
C194  22uF/6.3V  [C0603_DWS]  127.64,20.32 270 bottom
C195  22pF  [C0603_DWS]  120.9,16 180 bottom
C196  470nF  [C0603_DWS]  62.61,59.06 0 top
C197  22uF/6.3V  [C0603_DWS]  110.87,4.19 90 bottom
C198  22uF/6.3V  [C0603_DWS]  120.9,19.05 180 bottom
C199  22uF/6.3V  [C0603_DWS]  120.9,20.57 180 bottom
C200  10nF  [C0402_TI]  126.11,12.19 270 bottom
C201  3.3nF  [C0603_DWS]  115.82,10.79 0 bottom
C202  470uF/25V/LOWESR/105C  [E5-10,5]  128.02,5.46 180 top
C203  100nF  [C0603_DWS]  115.82,13.84 0 bottom
C204  22uF/6.3V  [C0603_DWS]  127,8.13 0 bottom
C205  22uF/6.3V  [C0603_DWS]  127,9.65 0 bottom
C206  22uF/6.3V  [C0603_DWS]  134.24,16.26 180 bottom
C207  22uF/6.3V  [C0603_DWS]  135.76,25.27 180 bottom
C208  22pF  [C0603_DWS]  140.34,32 0 bottom
C209  22uF/6.3V  [C0603_DWS]  134.24,12.95 270 bottom
C210  22uF/6.3V  [C0603_DWS]  134.24,22.1 180 bottom
C211  22uF/6.3V  [C0603_DWS]  140.34,26.54 0 bottom
C212  22uF/6.3V  [C0603_DWS]  140.34,28.07 0 bottom
C213  NA(22uF/6.3V)  [C0603_DWS]  109.35,4.19 90 bottom
C214  NA(22uF/6.3V)  [C0603_DWS]  14.61,77.09 0 bottom
C215  NA(22uF/6.3V)  [C0603_DWS]  14.61,78.61 0 bottom
C216  100nF  [C0603_DWS]  109.35,8.25 270 bottom
C217  220uF/10V/tant  [CT7343]  125.09,38.1 180 bottom
C218  1nF  [C0603_DWS]  95.25,6.1 90 bottom
C219  22uF/6.3V  [C0603_DWS]  138.94,44.96 0 top
C220  22uF/6.3V  [C0603_DWS]  139.57,37.59 180 top
C221  100nF  [C0603_DWS]  139.57,39.12 180 top
C222  NA(220uF/10V/tant)  [CT7343]  5.08,51.82 180 bottom
C223  NA(220uF/10V/tant)  [CT7343]  3.68,38.35 270 bottom
C224  220nF  [C0603_DWS]  91.31,29.72 270 top
C225  220nF  [C0603_DWS]  84.96,29.72 270 top
C226  220nF  [C0603_DWS]  92.84,29.72 90 top
C227  220nF  [C0603_DWS]  107.44,40.01 270 top
C228  220nF  [C0603_DWS]  94.36,29.72 270 top
C229  220nF  [C0603_DWS]  107.44,36.45 90 top
C230  220nF  [C0603_DWS]  95.88,29.72 90 top
C231  220nF  [C0603_DWS]  97.41,29.72 270 top
C232  220nF  [C0603_DWS]  105.03,33.27 270 top
CHGLED  LED/YELLOW/0603  [LED-0603]  140.21,21.72 180 top
D1  1N5819(S4SOD-123)  [SOD-123]  75.56,28.45 90 bottom
D3  1N5819(S4SOD-123)  [SOD-123]  104.01,13.46 180 bottom
D4  1N5822/SS34/SMA  [MLL-41]  130.18,12.45 0 bottom
D5  SMBJ16A  [DO214AA]  137.54,4.7 90 bottom
D6  1N5822/SS34/SMA  [MELF-MLL41]  138.43,13.72 90 bottom
ENTER  SIDE_WTCM-TR(3X4)  [SW_TAKT3X4]  39.37,1.91 180 bottom
ESC  SIDE_WTCM-TR(3X4)  [SW_TAKT3X4]  49.53,1.91 180 bottom
FET1  IRLML6402  [SOT23]  130.68,9.14 90 bottom
FET2  BSS138  [SOT23]  45.34,70.87 90 bottom
FET3  BSS138  [SOT23]  49.4,70.87 90 bottom
FET4  IRLML6402  [SOT23]  106.55,4.06 270 bottom
FUSE1  FSMD035  [1206]  13.59,63.75 270 bottom
GND  TESTPADTESTPAD_40-ROUND  [TESTPAD_40-ROUND]  38.1,79.63 0 bottom
GND_PIN  TESTPAD3  [TEST_PAD40/70/SQUARE]  121.67,3.81 0 top
GPIO-1  GBH-254-SMT-40  [ML40-MALE(GBH-254-SMT-40)]  24.13,41.28 90 top
GPIO-2  GBH-254-SMT-40  [ML40-MALE(GBH-254-SMT-40)]  59.69,5.71 180 top
GPIO-3  GBH-254-SMT-40  [ML40-MALE(GBH-254-SMT-40)]  115.57,41.28 270 top
HDMI  HDMI-SWM-19  [HDMI-SWM-19]  6.1,56.01 90 top
HEADPHONES  PJ-W47S-05D2-LF_V2  [PJ-W47S-05D2-LF_5PIN_V2]  142.32,51.87 180 top
HOME  SIDE_WTCM-TR(3X4)  [SW_TAKT3X4]  59.69,1.91 180 bottom
IPSOUT  TESTPADTESTPAD_40-ROUND  [TESTPAD_40-ROUND]  137.29,35.43 0 bottom
L1  FB0805/600R/200mA(201209-601)  [L0805_5MIL_DWS]  21.59,20.32 0 bottom
L2  FB0805/600R/200mA(201209-601)  [L0805_5MIL_DWS]  31.5,2.16 0 bottom
L3  FB0805/600R/200mA(201209-601)  [L0805_5MIL_DWS]  37.08,14.99 180 bottom
L4  CL470nH/0805/1.76R/250mA  [L0805_5MIL_DWS]  122.81,72.01 0 top
L5  CL470nH/0805/1.76R/250mA  [L0805_5MIL_DWS]  109.47,57.02 180 bottom
L6  FB0805/600R/2A  [L0805_5MIL_DWS]  8,27.31 90 bottom
L7  FB0805/600R/200mA(201209-601)  [L0805_5MIL_DWS]  9.52,20.07 270 bottom
L8  FB0805/600R/2A  [L0805_5MIL_DWS]  13.59,41.66 270 bottom
L10  FB0805/600R/2A  [L0805_5MIL_DWS]  13.59,35.05 270 bottom
L11  FB0805/600R/2A  [L0805_5MIL_DWS]  13.84,45.72 270 bottom
L12  2.2uH/1.5A/DCR<0.1R/CD32  [CD32]  129.16,40.13 0 top
L13  2.2uH/1.5A/DCR<0.1R/CD32  [CD32]  123.06,29.72 270 top
L14  2.2uH/1.5A/DCR<0.1R/CD32  [CD32]  130.56,22.73 0 top
L15  FB0805/600R/200mA(201209-601)  [L0805_5MIL_DWS]  132.21,53.09 0 top
L16  FB0805/600R/200mA(201209-601)  [L0805_5MIL_DWS]  127.89,55.12 0 top
L17  FB0805/600R/200mA(201209-601)  [L0805_5MIL_DWS]  132.21,55.12 0 top
L18  2.2uH/1.5A/DCR<0.1R/CD32  [CD32]  121.41,24.38 0 bottom
L19  10uH/3.15A/20%  [8X8MM_3131]  126.49,16.13 0 top
L20  2.2uH/1.5A/DCR<0.1R/CD32  [CD32]  137.95,19.41 270 bottom
L21  2.2uH/1.5A/DCR<0.1R/CD32  [CD32]  139.7,23.75 180 bottom
LAN  RJLBC-060TC1_GND_MILLING  [RJLBC-060TC1_MILLING]  6.1,8.89 270 top
LCD_CON  GBH-254-SMT-40  [ML40-MALE(GBH-254-SMT-40)]  59.69,76.84 0 top
LED1  LED/GREEN/0603  [LED-0603]  140.34,25.4 180 top
LIPO_BAT  DW02R  [DW02R]  135.89,13.21 90 top
MENU  SIDE_WTCM-TR(3X4)  [SW_TAKT3X4]  80.01,1.91 180 bottom
MIC2  NA(HN1x2)  [JP1]  42.16,63.75 90 top
MIC_IN  PJ-W47S-05D2-LF_V2  [PJ-W47S-05D2-LF_5PIN_V2]  142.32,62.28 180 top
NAND_E  Close  [SJ_1_SMALLER_CLOSE_10MILS]  47.5,17.27 180 bottom
ODT1  TESTPADTESTPAD_40-ROUND  [TESTPAD_40-ROUND]  107.19,31.11 90 top
PWR  YDJ-1136  [PWR_JACK_UNI_MILLING]  134.24,9.4 180 top
PWR_BUT  SIDE_WTCM-TR(3X4)  [SW_TAKT3X4]  128.02,1.91 180 bottom
PWR_LED  LED/RED/0603  [LED-0603]  140.21,18.03 180 top
Q1  4SB25.000F20E15/5x3.2mm/20ppm/20pF  [HCX-4S]  31.24,22.99 0 bottom
Q2  32768Hz/6pF  [MC-306]  90.04,23.88 0 top
Q3  4SB24.000F20E15/5x3.2mm/20ppm/20pF  [HCX-4S]  47.24,39.12 270 top
R1  2k/1%  [R0603_5MIL_DWS]  87.25,29.72 270 bottom
R2  2k/1%  [R0603_5MIL_DWS]  82.68,29.72 90 bottom
R3  1R  [R0603_5MIL_DWS]  74.04,56.26 180 top
R4  2k/1%  [R0603_5MIL_DWS]  75.56,51.05 0 bottom
R5  NA  [R0603_5MIL_DWS]  89.66,30.61 0 bottom
R6  2k/1%  [R0603_5MIL_DWS]  92.07,29.72 270 bottom
R7  330R/1%  [R0603_5MIL_DWS]  98.93,61.47 270 top
R8  2k/1%  [R0603_5MIL_DWS]  96.65,29.72 90 bottom
R9  330R/1%  [R0603_5MIL_DWS]  102.23,42.16 180 top
R10  10k  [R0603_5MIL_DWS]  109.73,50.17 0 bottom
R11  100k/1%  [R0603_5MIL_DWS]  109.73,48.13 0 bottom
R12  NA  [R0402_TI_0R]  75.56,49.78 0 bottom
R13  NA(2.2k)  [R0603_5MIL_DWS]  42.67,19.68 0 bottom
R14  NA(2.2k)  [R0603_5MIL_DWS]  42.67,21.21 180 bottom
R15  NA  [R0402_TI_0R]  75.56,48.9 0 bottom
R16  330R/1%  [R0603_5MIL_DWS]  70.74,52.45 180 top
R17  100k/1%  [R0603_5MIL_DWS]  42.29,6.86 0 bottom
R18  10k  [R0603_5MIL_DWS]  32.77,26.92 270 top
R19  10k  [R0603_5MIL_DWS]  31.24,24.89 90 top
R20  2k/1%  [R0603_5MIL_DWS]  21.84,10.92 180 bottom
R21  10k  [R0603_5MIL_DWS]  31.75,20.19 0 top
R22  560R  [R0603_5MIL_DWS]  6.1,6.35 180 bottom
R23  NA  [R0603_5MIL_DWS]  70.74,57.4 180 top
R24  0R(Board_Mounted)  [0603_0R]  74.04,57.79 180 top
R25  NA  [R0603_5MIL_DWS]  26.04,21.97 180 bottom
R26  560R  [R0603_5MIL_DWS]  6.1,11.43 180 bottom
R27  47k  [R0603_5MIL_DWS]  72.77,28.83 180 bottom
R28  47k  [R0603_5MIL_DWS]  66.93,22.73 0 top
R29  100k/1%  [R0603_5MIL_DWS]  122.81,78.36 180 top
R30  10k  [R0603_5MIL_DWS]  122.81,76.84 180 top
R31  1R  [R0603_5MIL_DWS]  59.69,54.86 180 bottom
R32  2.2k  [R0603_5MIL_DWS]  136.78,26.29 270 top
R33  10k  [R0603_5MIL_DWS]  122.81,79.88 180 top
R34  0R(Board_Mounted)  [0603_0R]  54.1,58.93 0 top
R35  NA(0R)  [R0603_5MIL_DWS]  70.74,55.88 180 top
R36  200k/1%  [R0603_5MIL_DWS]  54.1,55.88 180 top
R37  2k/1%  [R0603_5MIL_DWS]  17.91,62.74 90 top
R38  10k  [R0603_5MIL_DWS]  109.73,51.94 0 bottom
R39  2k/1%  [R0603_5MIL_DWS]  16.38,62.74 90 top
R40  47k  [R0603_5MIL_DWS]  14.86,62.74 90 top
R41  390R  [R0603_5MIL_DWS]  45.34,67.95 0 bottom
R42  4.99k/1%  [R0603_5MIL_DWS]  12.83,23.75 90 bottom
R43  51R  [R0603_5MIL_DWS]  45.34,73.79 0 bottom
R44  10k  [R0603_5MIL_DWS]  15.24,21.08 180 bottom
R45  13k/1%  [R0603_5MIL_DWS]  11.3,19.18 90 bottom
R46  10k  [R0603_5MIL_DWS]  11.3,23.75 270 bottom
R47  10k  [R0603_5MIL_DWS]  19.94,39.5 180 bottom
R48  6.8k/1%  [R0603_5MIL_DWS]  19.94,45.34 180 bottom
R49  NA  [R0603_5MIL_DWS]  77.47,69.22 270 top
R50  NA  [R0603_5MIL_DWS]  78.99,69.22 270 top
R51  1R  [R0603_5MIL_DWS]  54.1,36.07 270 top
R52  47k  [R0603_5MIL_DWS]  14.35,23.75 270 bottom
R53  1R  [R0603_5MIL_DWS]  53.21,42.55 270 top
R54  10k  [R0603_5MIL_DWS]  19.94,32.13 180 bottom
R55  13k/1%  [R0603_5MIL_DWS]  19.94,37.97 180 bottom
R56  200k/1%  [R0603_5MIL_DWS]  38.99,6.86 0 bottom
R57  2k/1%  [R0603_5MIL_DWS]  124.46,63.75 180 top
R58  100R  [R0603_5MIL_DWS]  135.25,40.89 270 top
R59  0.03R/1%  [R1206_5MIL_WS]  128.91,43.18 180 top
R60  1R  [R0603_5MIL_DWS]  70.74,53.98 0 bottom
R61  4.99k/1%  [R0603_5MIL_DWS]  129.54,65.53 0 top
R62  1R  [R0603_5MIL_DWS]  137.54,34.04 180 top
R63  1R  [R0603_5MIL_DWS]  137.54,32.51 180 top
R64  191R/1%  [R0603_5MIL_DWS]  54.1,52.96 180 bottom
R65  2.2k  [R0603_5MIL_DWS]  136.91,18.03 0 top
R66  1R  [R0603_5MIL_DWS]  49.28,43.43 0 top
R67  200k/1%  [R0603_5MIL_DWS]  133.73,26.29 90 top
R68  1R  [R0603_5MIL_DWS]  51.69,42.55 270 top
R69  0R(Board_Mounted)  [0603_0R]  126.75,24.38 180 bottom
R70  2.2k  [R0603_5MIL_DWS]  123.19,39.75 270 top
R71  1R  [R0603_5MIL_DWS]  59.69,56.77 0 bottom
R72  1R  [R0603_5MIL_DWS]  59.69,60.58 0 bottom
R73  2.2k  [R0603_5MIL_DWS]  122.94,34.29 0 top
R74  1R  [R0603_5MIL_DWS]  59.69,58.67 0 bottom
R75  2.2k  [R0603_5MIL_DWS]  122.94,35.81 180 top
R76  2.2k  [R0603_5MIL_DWS]  122.94,37.34 180 top
R77  4.99k/1%  [R0603_5MIL_DWS]  120.9,17.53 180 bottom
R78  3.32k/1%  [R0603_5MIL_DWS]  126.75,17.53 180 bottom
R79  47k  [R0603_5MIL_DWS]  115.82,12.32 180 bottom
R80  4.99k/1%  [R0603_5MIL_DWS]  120.4,8.13 0 bottom
R81  2.2k  [R0603_5MIL_DWS]  133.6,18.03 0 top
R82  2.2k  [R0603_5MIL_DWS]  98.93,10.16 270 bottom
R83  2.2k  [R0603_5MIL_DWS]  100.46,10.16 270 bottom
R84  47k  [R0603_5MIL_DWS]  93.73,10.16 270 bottom
R85  2.2k  [R0603_5MIL_DWS]  115.82,9.27 180 bottom
R86  1k/1%  [R0603_5MIL_DWS]  123.7,8.13 180 bottom
R87  0R(Board_Mounted)  [0603_0R]  122.05,6.6 0 bottom
R88  8.25k/1%  [R0603_5MIL_DWS]  131.83,17.14 270 bottom
R89  4.99k/1%  [R0603_5MIL_DWS]  140.34,30.48 0 bottom
R90  1.1k/1%  [R0603_5MIL_DWS]  131.83,21.21 90 bottom
R91  100k/1%  [R0603_5MIL_DWS]  97.28,6.1 270 bottom
R92  1.1k/1%  [R0603_5MIL_DWS]  137.92,31.37 90 bottom
R93  2.2k  [R0603_5MIL_DWS]  99.06,69.6 270 top
R94  2.2k  [R0603_5MIL_DWS]  97.54,69.6 270 top
R95  47k  [R0603_5MIL_DWS]  102.74,69.6 270 top
R96  6.81k/1%  [R0603_5MIL_DWS]  95.25,2.03 270 bottom
R97  8.25k/1%  [R0603_5MIL_DWS]  85.09,2.03 270 bottom
R98  10k/1%  [R0603_5MIL_DWS]  74.93,2.03 270 bottom
R99  11k/1%  [R0603_5MIL_DWS]  64.77,2.03 270 bottom
R100  13k/1%  [R0603_5MIL_DWS]  54.61,2.03 270 bottom
R101  16.2k/1%  [R0603_5MIL_DWS]  44.45,2.03 270 bottom
R102  22.1k/1%  [R0603_5MIL_DWS]  34.29,2.03 270 bottom
R103  51R  [R0603_5MIL_DWS]  49.4,73.79 0 bottom
R104  390R  [R0603_5MIL_DWS]  49.4,67.95 180 bottom
R105  10k  [R0603_5MIL_DWS]  95.25,10.16 270 bottom
R106  0R(Board_Mounted)  [R0402_TI_0R]  84.07,54.42 180 top
R107  0R(Board_Mounted)  [R0402_TI_0R]  84.07,55.31 180 top
R108  0R(Board_Mounted)  [R0402_TI_0R]  83.95,51.37 0 bottom
R109  0R(Board_Mounted)  [R0402_TI_0R]  83.95,52.26 0 bottom
R110  0R(Board_Mounted)  [R0402_TI_0R]  84.07,56.77 0 bottom
R111  0R(Board_Mounted)  [R0402_TI_0R]  84.33,47.37 180 top
R112  0R(Board_Mounted)  [R0402_TI_0R]  84.07,40.96 180 top
R113  0R(Board_Mounted)  [R0402_TI_0R]  83.82,33.15 180 top
R114  0R(Board_Mounted)  [R0402_TI_0R]  84.07,39.18 180 top
R115  0R(Board_Mounted)  [R0402_TI_0R]  84.07,40.07 180 top
R116  0R(Board_Mounted)  [R0402_TI_0R]  80.14,34.86 0 bottom
R117  0R(Board_Mounted)  [R0402_TI_0R]  80.14,35.75 0 bottom
R118  22R  [R0402_TI]  80.26,45.34 180 top
R119  22R  [R0402_TI]  80.26,46.23 180 top
R120  2.2k  [R0603_5MIL_DWS]  139.19,27.94 0 top
R121  NA(10k)  [R0603_5MIL_DWS]  50.67,17.27 180 bottom
R122  NA(0R)  [R0402_TI]  56.77,17.91 0 top
R123  NA(0R)  [R0402_TI]  56.77,18.8 0 top
R124  NA(0R)  [R0402_TI]  56.26,19.68 0 top
R125  NA(0R)  [R0402_TI]  56.77,16.13 180 top
R126  NA(0R)  [R0402_TI]  56.26,20.57 0 top
R127  NA(0R)  [R0402_TI]  51.69,20.17 90 bottom
R128  NA(0R)  [R0402_TI]  50.93,21.59 180 bottom
R129  NA(0R)  [R0402_TI]  55.88,20.51 0 bottom
R130  NA(0R)  [R0402_TI]  56.77,17.02 180 top
R131  NA(0R)  [R0402_TI]  36.2,26.16 270 bottom
R132  NA(0R)  [R0402_TI]  51.18,18.54 180 bottom
R133  22R  [R0402_TI]  121.79,51.44 270 top
R134  22R  [R0402_TI]  124.08,51.44 270 top
R135  22R  [R0402_TI]  122.94,51.44 270 top
R136  10k  [R0603_5MIL_DWS]  112.39,8.25 270 bottom
R137  10k  [R0603_5MIL_DWS]  107.7,1.27 180 bottom
R138  4.99k/1%  [R0603_5MIL_DWS]  110.87,8.25 90 bottom
R139  10M  [R0402_TI]  83.69,23.88 90 top
RECOVERY  SIDE_WTCM-TR(3X4)  [SW_TAKT3X4]  107.31,80.65 0 bottom
RESET  SIDE_WTCM-TR(3X4)  [SW_TAKT3X4]  128.02,80.65 0 bottom
RM1  RA0805_(4X0402)_0R(Board_Mounted)  [R_MATRIX_4_0402_25_625_0R]  80.9,52.96 90 top
RM2  RA0805_(4X0402)_0R(Board_Mounted)  [R_MATRIX_4_0402_25_625_0R]  78.49,54.48 90 top
RM3  RA0805_(4X0402)_0R(Board_Mounted)  [R_MATRIX_4_0402_25_625_0R]  78.49,51.44 90 top
RM4  RA0805_(4X0402)_0R(Board_Mounted)  [R_MATRIX_4_0402_25_625_0R]  80.14,48.77 90 top
RM5  RA0805_(4X0402)_0R(Board_Mounted)  [R_MATRIX_4_0402_25_625_0R]  80.14,40.13 90 top
RM6  RA0805_(4X0402)_0R(Board_Mounted)  [R_MATRIX_4_0402_25_625_0R]  80.14,42.8 90 top
RM7  RA0805_(4X0402)_0R(Board_Mounted)  [R_MATRIX_4_0402_25_625_0R]  80.14,37.47 90 top
RM8  RA0805_(4X0402)_0R(Board_Mounted)  [R_MATRIX_4_0402_25_625_0R]  80.14,34.8 90 top
RM9  RA1206_(4X0603)_4B8_4.7k  [R_MATRIX_4]  37.08,10.41 270 bottom
RM10  RA1206_(4X0603)_4B8_4.7k  [R_MATRIX_4]  28.07,5.46 180 bottom
RM13  RA1206_(4X0603)_4B8_51R  [R_MATRIX_4]  21.08,13.84 90 bottom
RM14  RA1206_(4X0603)_4B8_100K  [R_MATRIX_4]  122.81,68.96 270 top
RM15  RA1206_(4X0603)_4B8_100K  [R_MATRIX_4]  107.57,60.07 270 bottom
RM16  RA0805_(4X0402)_0R(Board_Mounted)  [R_MATRIX_4_0402_25_625_0R]  80.77,48.64 90 bottom
RM17  RA0805_(4X0402)_0R(Board_Mounted)  [R_MATRIX_4_0402_25_625_0R]  83.44,47.62 90 bottom
RM18  RA0805_(4X0402)_0R(Board_Mounted)  [R_MATRIX_4_0402_25_625_0R]  79.25,45.59 90 bottom
RM19  RA0805_(4X0402)_0R(Board_Mounted)  [R_MATRIX_4_0402_25_625_0R]  81.91,44.58 90 bottom
RM20  RA0805_(4X0402)_0R(Board_Mounted)  [R_MATRIX_4_0402_25_625_0R]  79.5,42.55 90 bottom
RM21  RA0805_(4X0402)_0R(Board_Mounted)  [R_MATRIX_4_0402_25_625_0R]  82.55,38.99 90 bottom
RM24  RA1206_(4X0603)_4B8_75R  [R_MATRIX_4]  41.27,68.33 180 bottom
RM25  RA1206_(4X0603)_4B8_10k  [R_MATRIX_4]  118.11,34.29 90 bottom
SATA  SATA-PWA-07  [SATA-PWA-07]  5.88,73.77 90 top
SCKE1  TESTPADTESTPAD_40-ROUND  [TESTPAD_40-ROUND]  107.19,33.66 180 top
SD/MMC1  MICRO_SD/MMC_CP_NEWTFC-WPAPR-08  [TFC-WPAPR-08]  133.74,74.04 0 top
SD/MMC2  PSD006A-LT2-BA0  [SD_CARD]  127.76,55.23 180 bottom
SEARCH  SIDE_WTCM-TR(3X4)  [SW_TAKT3X4]  69.85,1.91 180 bottom
T1  BC846B  [SOT23]  106.55,8.25 180 bottom
U1  A20  [TFBGA441]  67.86,40.1 90 top
U2  K4B4G1646D-BCK0  [FBGA96_MEM]  96.56,54.6 0 top
U3  K4B4G1646D-BCK0  [FBGA96_MEM]  96.56,36.6 0 top
U4  FIDUCIAL  [FIDUCIAL-1X3]  121.03,81.41 0 bottom
U5  FIDUCIAL  [FIDUCIAL-1X3]  121.03,1.14 0 bottom
U6  AT24C16BN-SH  [SO-08MN]  42.42,14.22 0 bottom
U7  RTL8201CP  [LQFP48]  29.21,13.08 270 bottom
U8  H27UBG8T2BTR  [TSOP48]  44.32,23.11 0 top
U9  SY6280  [SOT23-5]  14.73,18.67 0 bottom
U10  SY6280  [SOT23-5]  19.81,42.42 90 bottom
U11  SY6280  [SOT23-5]  19.81,35.05 90 bottom
U12  AXP209(QFN48)  [QFN48]  130.81,32.77 270 top
U13  SY8008C(AA)C  [SOT23-5]  124.71,20.19 0 bottom
U14  MP1482DS  [SOIC8]  121.41,11.56 270 bottom
U15  SY8008C(AA)C  [SOT23-5]  136.27,27.81 180 bottom
U16  SY7208(SOT23-6)  [SOT23-6]  134.37,19.18 0 bottom
U17  RCLAMP0524P  [SLP2510P8]  15.16,53.09 90 top
U18  FIDUCIAL  [FIDUCIAL-1X3]  18.8,1.14 0 bottom
U19  FIDUCIAL  [FIDUCIAL-1X3]  18.92,1.14 180 top
U20  FIDUCIAL  [FIDUCIAL-1X3]  120.9,1.14 180 top
U21  FIDUCIAL  [FIDUCIAL-1X3]  113.03,79.38 180 top
U22  RCLAMP0524P  [SLP2510P8]  15.16,56.13 90 top
U23  RCLAMP0524P  [SLP2510P8]  15.16,59.06 90 top
U$5  [LOGO-OPENHARDWARE_8X8]  35.94,59.44 0 top
U$6  [OLIMEX1_V]  52.07,72.14 0 bottom
U$8  [OLIMEX1_V]  106.04,43.56 0 top
U$9  [PB]  37.08,41.28 0 top
U$10  [ESD_SYMBOL]  38.23,36.58 0 top
U$11  [RECYCLE_BIN1/8]  29.72,36.45 0 top
U$12  [ROHS]  31.12,45.34 0 top
UART0  HN1X4  [HN1X4]  93.98,13.34 0 top
UEXT1  GBH-254-SMT-10  [ML10_S]  99.06,76.84 0 top
UEXT2  GBH-254-SMT-10  [ML10_S]  99.06,5.71 180 top
USB_HOST  USB_TWO_LEVEL  [USB_TWO_LEVEL]  8.13,38.35 270 top
USB_OTG  USB-OTG  [USB_MINI_9PIN]  4.32,23.76 0 top
VGA  WU06S  [CON1.27MM-6-SMALL_ICSP]  27.69,76.84 90 top
VOL+  SIDE_WTCM-TR(3X4)  [SW_TAKT3X4]  100.33,1.91 180 bottom
VOL-  SIDE_WTCM-TR(3X4)  [SW_TAKT3X4]  90.17,1.91 180 bottom
VPS+  Open  [SJ_1_SMALLER]  53.21,16 0 bottom
VPS-  Open  [SJ_1_SMALLER]  53.21,17.27 0 bottom
VR1  AP1231-2.5V(SOT23-5)  [SOT-23-5]  139.45,42.04 180 top

## Tracks (layer width: path | path; a pad name or v marks a point on that pad's centre or on a via)
+5V  (via drill 0.6, 0.6 pad 0.46, 0.8)
  Top 0.813: v35.56,70.74 37.21,69.09 45.85,69.09 46.99,67.95 v47.37,67.95
  Top 1.016: R37.2 R39.2 v16.38,64.64 16.38,65.15 14.99,66.55 v13.59,66.55 | GPIO-1.1 25.53,17.14 v25.53,18.29 | GPIO-3.1 114.05,65.41 v114.05,68.71 | v35.56,70.74 LCD_CON.1 | GPIO-2.1 83.82,7.11 v85.09,7.11 | v17.78,24.57 17.78,16.76 v17.27,16.26
  Route15 1.016: 17.14,32.13 17.14,33.27 | 17.14,33.27 v17.14,39.88 17.14,47.24 15.18,49.21 15.18,59.88 13.59,61.47 v13.59,66.55 | v132.97,45.21 132.97,41.78 137.8,36.96 137.8,32.39 140.46,29.72 140.46,26.8 138.68,25.02 138.68,12.83 136.53,10.67 131.06,10.67 | v86.23,7.11 86.3,7.05 86.3,6.6 84.96,6.6 84.96,7.11 v85.09,7.11 | 17.78,31.5 17.91,31.5 17.91,32.51 17.14,33.27
  Route15 1.27: 17.78,25.78 v17.78,24.57 18.99,24.57 | 17.78,25.78 17.78,31.5 17.14,32.13 v16.83,32.13 | 18.99,24.57 25.27,18.29 | v54.61,7.11 38.35,7.11 36.7,8.76 26.29,8.76 25.27,9.78 25.27,18.29 | 25.27,18.29 v25.53,18.29 | 129.92,10.67 128.27,10.67 127.38,9.78 106.3,9.78 103.63,7.11 | v85.09,7.11 v86.23,7.11 103.63,7.11 | 129.92,10.67 v129.92,12.32 130.43,12.32 | 129.92,10.67 130.43,10.67 | 130.43,12.32 v131.06,12.32 131.06,10.67 130.43,10.67 | 130.43,10.67 130.43,12.32 | 17.78,25.78 18.99,24.57 | v105.66,1.27 103.63,3.3 103.63,7.11
  Route15 1.524: v54.61,7.11 v57.15,7.11 | v13.59,66.55 v13.59,67.69
  Bottom 0.254: v35.56,70.74 +5V.1
  Bottom 0.305: U10.5 18.86,40.89 C128.1 | U9.5 16.13,17.72 C125.1
  Bottom 0.508: 129.92,14.73 5V_E.2 | R104.1 v47.37,67.95 R41.1 | FET4.2 105.49,2.96 104.52,3.94 5V_E_SATA.1
  Bottom 0.61: C136.1 18.86,33.53 U11.5 | C128.1 17.14,40.77 v17.14,39.88
  Bottom 0.762: v129.92,12.32 129.92,14.73
  Bottom 1.016: 131.63,12.32 FET1.2 | v16.83,32.13 17.27,32.58 C136.1 | v129.92,12.32 v131.06,12.32 131.63,12.32 | 131.63,12.32 132.62,12.32 D4.K | 13.59,70.74 v35.56,70.74 | v114.05,68.71 115.82,68.71 117.86,66.68 130.3,66.68 132.97,64.01 v132.97,45.21 | C125.1 v17.27,16.26 | 13.59,78.61 C215.2 C214.2 13.59,77.09 | 14.48,80.77 5V_PWR.1 | v85.09,7.11 84.71,7.11 84.71,6.73 84.84,6.6 86.3,6.6 86.36,6.67 86.36,7.05 | FET4.2 105.6,1.33 v105.66,1.27 R137.1
  Bottom 1.27: v13.59,67.69 13.59,70.74 13.59,77.09 13.59,78.61 13.59,79.88 14.48,80.77 | v57.15,7.11 v85.09,7.11 v86.23,7.11 | v57.15,7.11 v54.61,7.11 54.61,6.86 57.15,6.86 v57.15,7.11
  Bottom 1.524: FUSE1.1 v13.59,66.55 v13.59,67.69
+5V_OTG_PWR  (via drill 0.4, 0.4 pad 0.46, 0.6)
  Top 0.203: U12.31 134.47,32.97 134.72,32.72
  Top 0.508: R63.2 136.45,32.72 v135.36,32.72 v134.75,32.72 134.72,32.72 | USB_OTG.VBUS 6.73,25.36 v6.73,26.29
  Route15 0.61: v10.8,25.91 13.34,23.37 18.41,23.37 24.07,17.72 24.07,8.83 26.29,6.6 32.51,6.6 34.29,4.83 36.58,4.83 37.72,5.97 v43.94,5.97 | v82.22,5.97 84.51,8.25 102.87,8.25 105.66,11.05 126.75,11.05 135.57,19.88 135.57,26.1 137.16,27.69 137.16,29.97 135.76,31.37 135.76,32.31 v135.36,32.72 v134.75,32.72
  Bottom 0.61: v10.8,25.91 10.16,25.91 C124.1 L6.1 v6.73,26.29 | v135.36,32.72 v134.75,32.72 | v82.22,5.97 58.04,5.97 57.72,5.65 54.04,5.65 53.72,5.97 v43.94,5.97 43.18,6.73 R17.1
+15V  (via drill 0.6, 0.6 pad 0.46)
  Top 0.203: U12.32 134.77,33.37 134.77,33.55 134.77,33.77 U12.33
  Top 0.61: R62.2 135.71,34.04 v135.51,33.83 135.23,33.55 134.77,33.55
  Top 1.016: v118.24,8.13 v128.93,8.13 | 129.59,15.49 129.59,14.48 v127.13,14.48 v127.13,15.49 129.59,15.49 | 129.59,15.49 L19.2 129.59,18.03 R81.1
  Route15 0.813: v135.51,33.83 134.54,33.83 133.86,33.15 133.86,31.75 132.21,30.1 130.56,30.1 129.67,29.21 129.67,24.51 127.13,21.97 v127.13,15.49
  Route15 1.27: v127.13,14.48 v127.13,15.49
  Bottom 0.254: 127.13,15.24 5VEXT.1
  Bottom 0.508: 128.78,14.73 5V_E.1
  Bottom 1.016: 127.76,12.45 127.89,12.45 127.89,10.08 | 127.89,10.08 C205.1 C204.1 v128.93,8.13 | 127.76,12.45 D4.A | 127.76,12.45 127.76,14.48 | 127.76,14.48 127.76,14.73 | FET1.1 129.73,10.08 127.89,10.08 | 127.76,14.73 128.78,14.73 | v118.24,8.13 R80.2 | 127.76,14.73 127.13,14.73 | 127.76,14.48 v127.13,14.48
  Bottom 1.27: v127.13,15.49 127.13,15.24 127.13,14.73 v127.13,14.48
+24V  (via drill 0.4, 0.6)
  Top 0.203: U12.38 132.61,36.53 132.41,36.53 132.21,36.53 U12.39 | v131.29,37.85 131.29,37.44 131.01,37.16 U12.42
  Top 0.61: 132.41,36.53 v132.66,36.78 v133.27,36.78 | C150.2 125.09,42.16 125.86,42.93 v126.11,42.93
  Top 1.016: v126.11,42.93 127.19,42.93 R59.2 | C150.2 C152.1 v122.17,42.16
  Route15 0.508: v133.27,36.78 133.27,36.65 134.11,35.81 135.76,35.81 136.53,35.05 136.53,31.75 137.99,30.29 137.99,27.24 137.67,26.92 137.67,13.99 LIPO_BAT.1
  Bottom 0.254: LIPO_BAT.1 136.38,12.7 139.83,12.7 BAT.1
  Bottom 0.813: v133.27,36.78 v132.66,36.78 132.36,36.78 v131.29,37.85 130.68,38.46 130.68,39.12 126.87,42.93 v126.11,42.93
  Bottom 1.016: LIPO_BAT.1 135.75,12.07 C209.2
ADBG  (via drill 0.25)
  Top 0.127: U1.N8 v71.46,41.3
BA0  (via drill 0.25)
  Top 0.127: v105.41,40.26 105.22,40.07 105.22,38.29 103.38,36.45 100.96,36.45 99.76,35.24 99.76,34.6 U3.M2 | v105.41,52.7 105.16,52.7 103.38,54.48 100.9,54.48 99.76,53.34 99.76,52.6 U2.M2 | v95.25,41.85 95.44,42.04 96.58,42.04 97.34,41.28 98.99,41.28 101.15,43.43 104.84,43.43 v105.54,44.13
  Bottom 0.127: v105.41,40.26 105.6,40.45 105.6,44.07 v105.54,44.13 105.54,44.39 104.96,44.96 104.96,47.24 105.22,47.5 105.22,52.51 v105.41,52.7 | v95.25,41.85 95.06,41.66 86.87,41.66 83.45,38.24 RM21.1.2
BA1  (via drill 0.25, 0.25 pad 0.46)
  Top 0.127: v93.53,42.61 93.72,42.8 96.96,42.8 97.34,42.42 98.87,42.42 v99.5,43.05 | v99.76,57.4 U2.N8 | v99.76,39.4 U3.N8